# Altium project in3ator.PrjPcb (part 1 of 2)
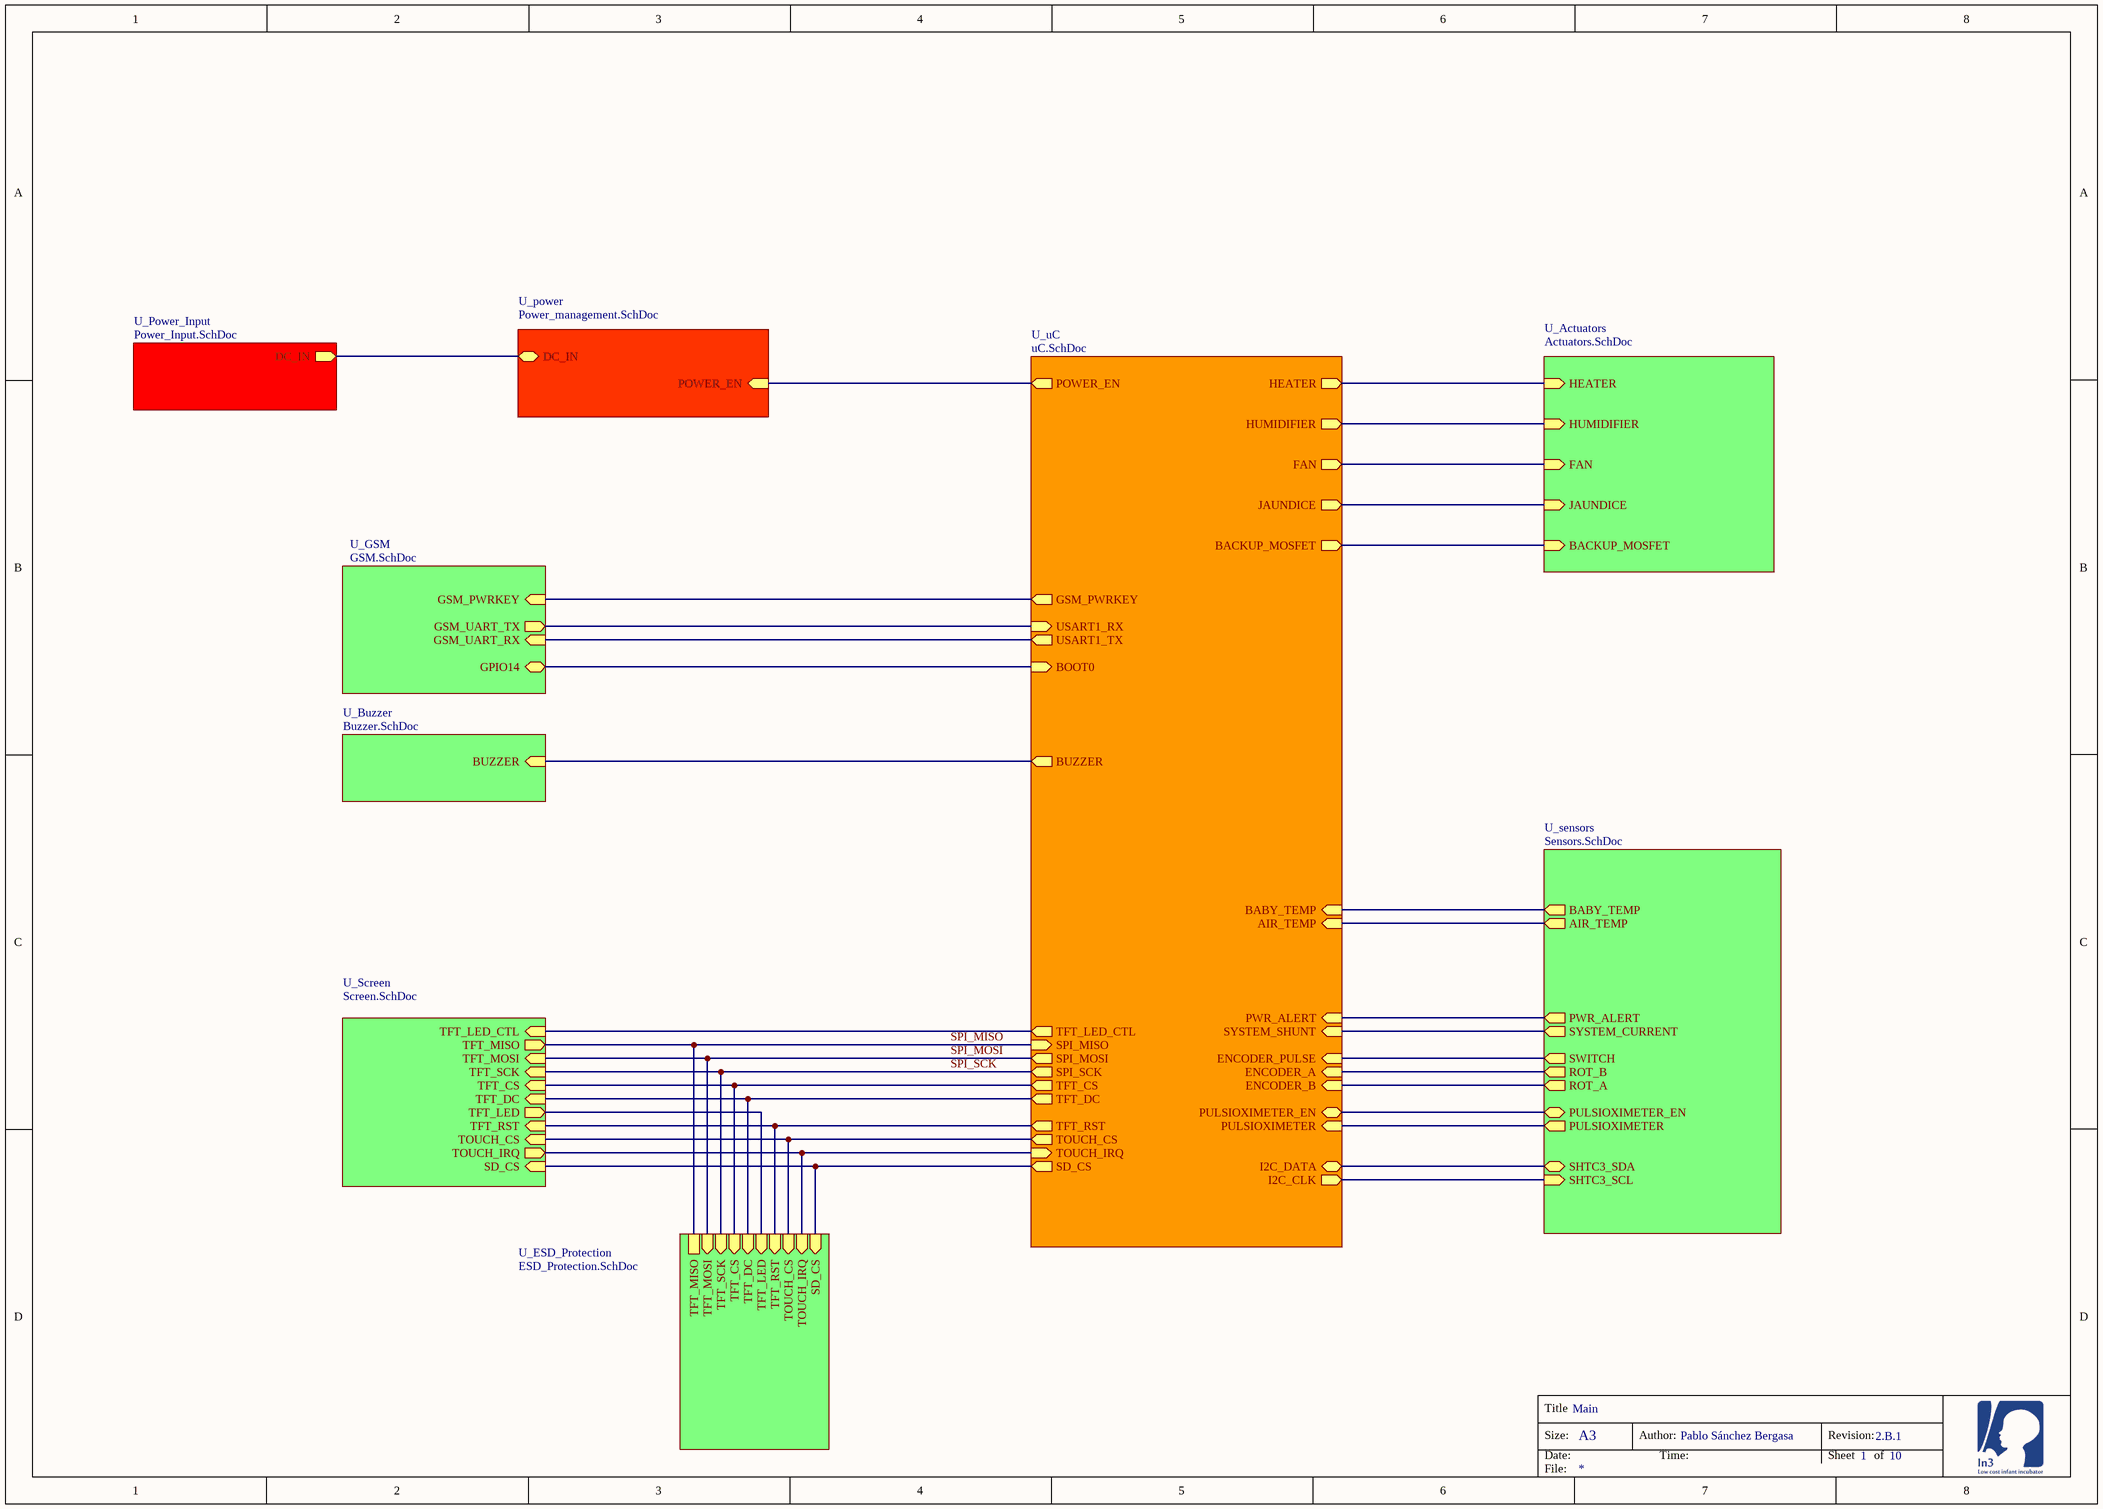
[diagram p0: in3ator.SchDoc]
Author_in3: Pablo Sánchez Bergasa; Revision_in3: 2.B.1; SheetTotal_in3: 10
10 sheets, 142 parts. Net scope: hierarchical (ports join the sheet entries above them; power ports are global).
Sheets:
  in3ator.SchDoc
    U_power = Power_management.SchDoc
    U_GSM = GSM.SchDoc
    U_sensors = Sensors.SchDoc
    U_uC = uC.SchDoc
    U_Power_Input = Power_Input.SchDoc
    U_Actuators = Actuators.SchDoc
    U_Buzzer = Buzzer.SchDoc
    U_Screen = Screen.SchDoc
    U_ESD_Protection = ESD_Protection.SchDoc

## Sheet in3ator.SchDoc: Main
size A3; Date: 17/09/18; Author: Pablo Sánchez Bergasa; Revision: 2.A.1; SheetNumber: 1; SheetTotal: 9; DocumentName: Main

### Sub-sheets
U_Actuators = Actuators.SchDoc: HEATER (in), HUMIDIFIER (in), JAUNDICE (in), FAN (in), BACKUP_MOSFET (in)
U_Buzzer = Buzzer.SchDoc: BUZZER (in)
U_ESD_Protection = ESD_Protection.SchDoc: SD_CS (in), TFT_CS (in), TOUCH_CS (in), TOUCH_IRQ (in), TFT_RST (in), TFT_DC (in), TFT_MOSI (in), TFT_SCK (in), TFT_LED (in), TFT_MISO
U_GSM = GSM.SchDoc: GSM_UART_TX (out), GSM_UART_RX (in), GSM_PWRKEY (in), GPIO14
U_power = Power_management.SchDoc: POWER_EN (in), DC_IN
U_Power_Input = Power_Input.SchDoc: DC_IN
U_Screen = Screen.SchDoc: SD_CS (in), TFT_CS (in), TOUCH_CS (in), TOUCH_IRQ (out), TFT_RST (in), TFT_DC (in), TFT_MOSI (in), TFT_MISO, TFT_LED_CTL (in), TFT_SCK (in), TFT_LED (out)
U_sensors = Sensors.SchDoc: SYSTEM_CURRENT (out), SWITCH (out), ROT_B (out), ROT_A (out), PULSIOXIMETER_EN, SHTC3_SCL (in), SHTC3_SDA (bidir), PWR_ALERT (out), PULSIOXIMETER (out), BABY_TEMP (out), AIR_TEMP (out)
U_uC = uC.SchDoc: SYSTEM_SHUNT (in), HEATER (out), BUZZER (out), JAUNDICE (out), HUMIDIFIER (out), POWER_EN (out), BOOT0 (in), FAN (out), I2C_DATA (bidir), I2C_CLK (out), SPI_MISO, SPI_SCK (out), SPI_MOSI (out), TOUCH_IRQ (in), TFT_DC (out), TFT_CS (out), TFT_RST (out), TOUCH_CS (out), SD_CS (out), TFT_LED_CTL (out), GSM_PWRKEY (out), USART1_RX (in), USART1_TX (out), ENCODER_PULSE (in), ENCODER_A (in), ENCODER_B (in), PULSIOXIMETER (in), PWR_ALERT (in), PULSIOXIMETER_EN, BACKUP_MOSFET (out), BABY_TEMP (in), AIR_TEMP (in)

### Nets
3v3_pulsioximeter: sheet U_sensors/PULSIOXIMETER_EN, sheet U_uC/PULSIOXIMETER_EN
DC_IN: sheet U_power/DC_IN, sheet U_Power_Input/DC_IN
GSM_RX: sheet U_GSM/GSM_UART_RX, sheet U_uC/USART1_TX
GSM_TX: sheet U_GSM/GSM_UART_TX, sheet U_uC/USART1_RX
PULSIOXIMETER_: sheet U_sensors/PULSIOXIMETER, sheet U_uC/PULSIOXIMETER
SCL: sheet U_sensors/SHTC3_SCL, sheet U_uC/I2C_CLK
SD_CS: sheet U_uC/SD_CS, sheet U_Screen/SD_CS, sheet U_ESD_Protection/SD_CS
SDA: sheet U_sensors/SHTC3_SDA, sheet U_uC/I2C_DATA
SPI_MISO: sheet U_uC/SPI_MISO, sheet U_Screen/TFT_MISO, sheet U_ESD_Protection/TFT_MISO
SPI_MOSI: sheet U_uC/SPI_MOSI, sheet U_Screen/TFT_MOSI, sheet U_ESD_Protection/TFT_MOSI
SPI_SCK: sheet U_uC/SPI_SCK, sheet U_Screen/TFT_SCK, sheet U_ESD_Protection/TFT_SCK
SYS_CURRENT: sheet U_sensors/SYSTEM_CURRENT, sheet U_uC/SYSTEM_SHUNT
TFT_CS: sheet U_uC/TFT_CS, sheet U_Screen/TFT_CS, sheet U_ESD_Protection/TFT_CS
TFT_DC: sheet U_uC/TFT_DC, sheet U_Screen/TFT_DC, sheet U_ESD_Protection/TFT_DC
TFT_LED: sheet U_Screen/TFT_LED, sheet U_ESD_Protection/TFT_LED
TFT_LED_CTL: sheet U_uC/TFT_LED_CTL, sheet U_Screen/TFT_LED_CTL
TFT_RST: sheet U_uC/TFT_RST, sheet U_Screen/TFT_RST, sheet U_ESD_Protection/TFT_RST
TOUCH_CS: sheet U_uC/TOUCH_CS, sheet U_Screen/TOUCH_CS, sheet U_ESD_Protection/TOUCH_CS
TOUCH_IRQ: sheet U_uC/TOUCH_IRQ, sheet U_Screen/TOUCH_IRQ, sheet U_ESD_Protection/TOUCH_IRQ
NetC17_1: sheet U_sensors/BABY_TEMP, sheet U_uC/BABY_TEMP
NetC18_2: sheet U_sensors/ROT_A, sheet U_uC/ENCODER_B
NetC19_2: sheet U_sensors/ROT_B, sheet U_uC/ENCODER_A
NetC20_2: sheet U_sensors/SWITCH, sheet U_uC/ENCODER_PULSE
NetC34_1: sheet U_sensors/AIR_TEMP, sheet U_uC/AIR_TEMP
NetQ2_1: sheet U_uC/HEATER, sheet U_Actuators/HEATER
NetQ3_1: sheet U_uC/HUMIDIFIER, sheet U_Actuators/HUMIDIFIER
NetQ4_1: sheet U_uC/FAN, sheet U_Actuators/FAN
NetQ5_1: sheet U_uC/JAUNDICE, sheet U_Actuators/JAUNDICE
NetQ6_1: sheet U_uC/BACKUP_MOSFET, sheet U_Actuators/BACKUP_MOSFET
NetR7_1: sheet U_GSM/GPIO14, sheet U_uC/BOOT0
NetR13_1: sheet U_GSM/GSM_PWRKEY, sheet U_uC/GSM_PWRKEY
NetR44_2: sheet U_uC/BUZZER, sheet U_Buzzer/BUZZER
NetR48_1: sheet U_power/POWER_EN, sheet U_uC/POWER_EN
NetU1#2_56: sheet U_sensors/PWR_ALERT, sheet U_uC/PWR_ALERT

### Notes on the sheet
- Title
- Size:
- Date:
- A3
- Author:
- Time:
- Revision:
- Sheet
- of
- File:

## Sheet Power_management.SchDoc: Power
size A3; SheetNumber: 3
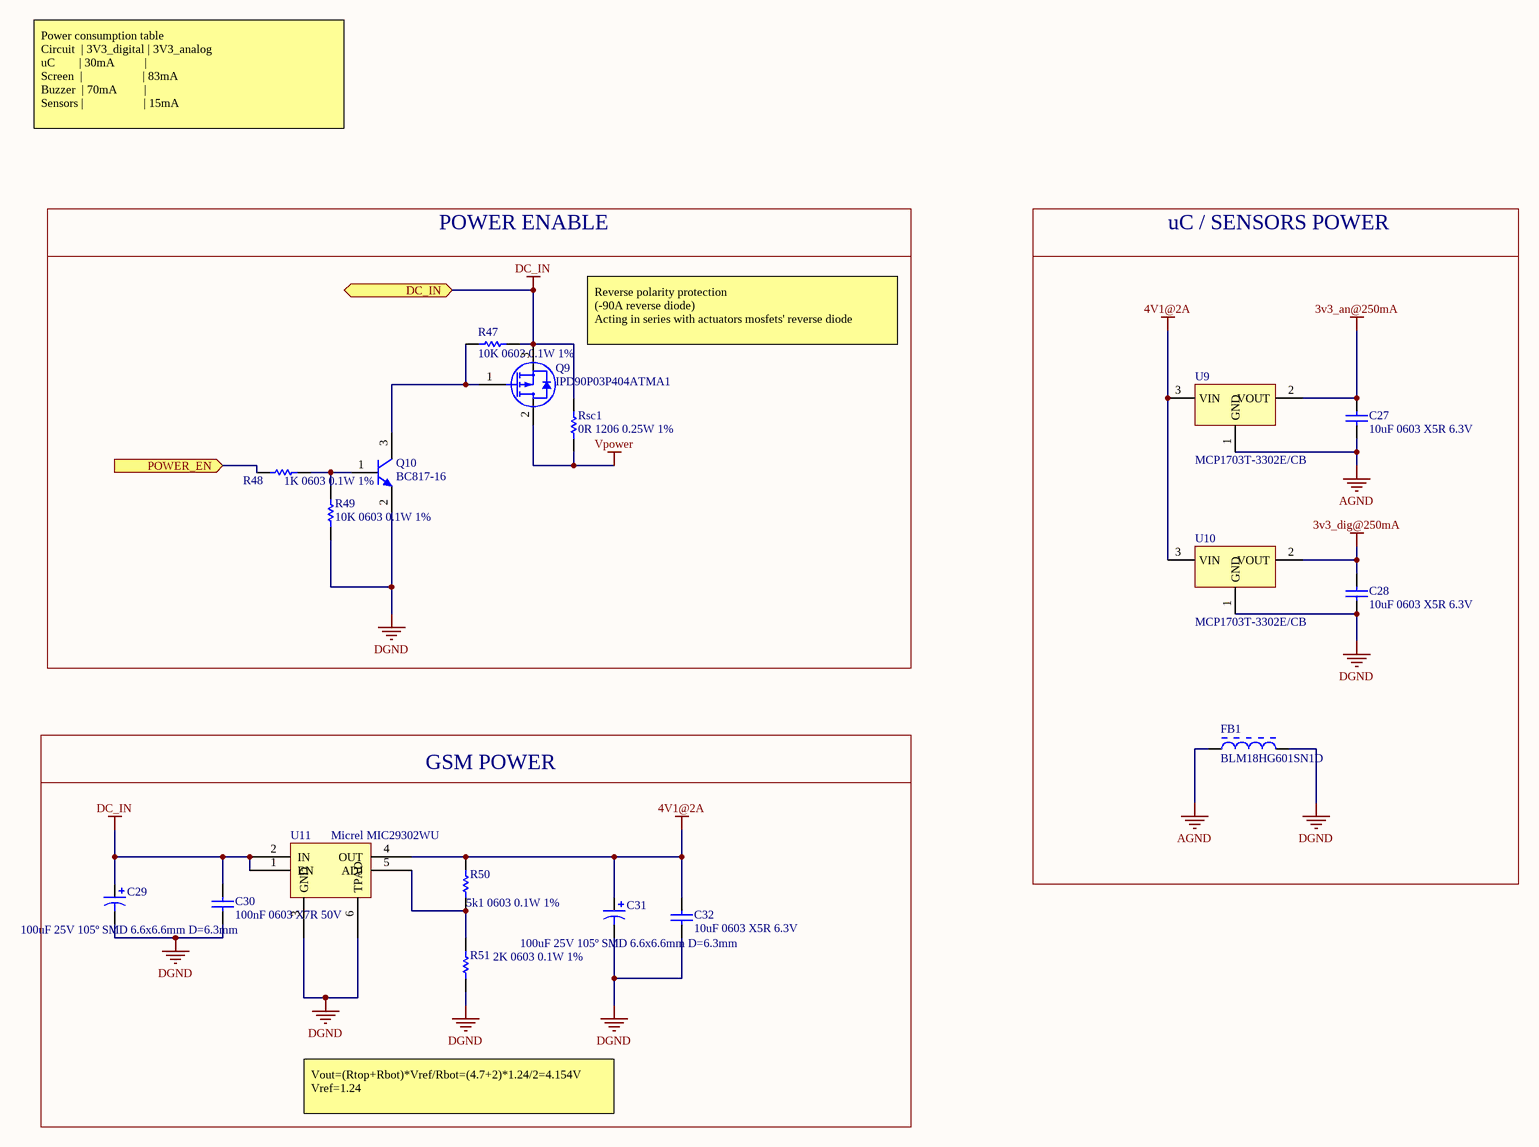
[diagram p1: Power_management.SchDoc]

### Parts
C27  10uF 0603 X5R 6.3V  [CAPC1608X60X35NL10T15]
C28  10uF 0603 X5R 6.3V  [CAPC1608X60X35NL10T15]
C29  100uF 25V 105º SMD 6.6x6.6mm D=6.3mm  [PCB-5eg0a5nygcrzw5ibm1j9-1]
C30  100nF 0603 X7R 50V  [CAPC1608X60X35NL10T15]
C31  100uF 25V 105º SMD 6.6x6.6mm D=6.3mm  [PCB-5eg0a5nygcrzw5ibm1j9-1]
C32  10uF 0603 X5R 6.3V  [CAPC1608X60X35NL10T15]
FB1  BLM18HG601SN1D  [MURA-BLM18-F-H1-CHIP-2_V]
Q9  IPD90P03P404ATMA1  [DPAK IPD90P03P404ATMA1]
Q10  BC817-16  [PCB-856332-1]
R47  10K 0603 0.1W 1%  [RESC1609X55X30ML10T20]
R48  1K 0603 0.1W 1%  [RESC1609X55X30ML10T20]
R49  10K 0603 0.1W 1%  [RESC1609X55X30ML10T20]
R50  5k1 0603 0.1W 1%  [RESC1609X55X30ML10T20]
R51  2K 0603 0.1W 1%  [RESC1609X55X30ML10T20]
Rsc1  0R 1206 0.25W 1%  [PCB-sxvxwfnl72ysl1kmtzgv-1]  (no BOM)
U9  MCP1703T-3302E/CB  [SOT-23A-CB3_L]
U10  MCP1703T-3302E/CB  [SOT-23A-CB3_L]
U11  Micrel MIC29302WU  [TI-KTT5_N]

### Blocks framed on the sheet
POWER ENABLE: Q9 Q10 R47-R49 Rsc1
uC / SENSORS POWER: C27 C28 FB1 U9 U10
GSM POWER: C29-C32 R50 R51 U11

### Ports
DC_IN, POWER_EN (in)

### Nets
3v3_an@250mA: C27.2 U9.2(VOUT)
3v3_dig@250mA: C28.2 U10.2(VOUT)
4V1@2A: C31.1 C32.2 R50.2 U9.3(VIN) U10.3(VIN) U11.4(OUT)
AGND: C27.1 FB1.1 U9.1(GND)
DC_IN: C29.1 C30.2 Q9.3(S) R47.2 Rsc1.2 U11.1(EN) U11.2(IN) ; port DC_IN
DGND: C28.1 C29.2 C30.1 C31.2 C32.1 FB1.2 Q10.2(E) R49.2 R51.1 U10.1(GND) U11.3(GND) U11.6(TPAD)
Vpower: Q9.2(D) Rsc1.1
NetQ9_1: Q9.1(G) Q10.3(C) R47.1
NetQ10_1: Q10.1(B) R48.2 R49.1
NetR48_1: R48.1 ; port POWER_EN
NetR50_1: R50.1 R51.2 U11.5(ADJ)

### Notes on the sheet
- Power consumption table
  Circuit  | 3V3_digital | 3V3_analog
  uC        | 30mA          |
  Screen  |                    | 83mA
  Buzzer  | 70mA         |
  Sensors |                    | 15mA
- Reverse polarity protection
  (-90A reverse diode)
  Acting in series with actuators mosfets' reverse diode
- Vout=(Rtop+Rbot)*Vref/Rbot=(4.7+2)*1.24/2=4.154V
  Vref=1.24
- Title
- Size:
- Date:
- A3
- Author:
- Time:
- Revision:
- Sheet
- of
- File:

### Library data of the parts
C27 C28 C32 = CMP-121364-8: Rated voltage: 6v3; Dielectric carachteristic: X5R; Capacitance: 10uF; package: 0603
C29 C31 = CMP-a6d16ad512617916-1: Manufacturer Part Number: VZL101M1ETR-0607; Tolerance: 20%; Octopart URL: https://octopart.com/vzl101m1etr-0607-lelon-84840918; OctopartID: a6d16ad512617916; Capacity: 100uF; Voltage rating: 25V
C30 = CMP-c41a0d2b65641bdd-3: 100nF 0603 X7R 25V; package: 0603; capacitance: 100 nF; Dielectric Characteristic: X7R; Rated voltage: 25V
FB1 = CMP-19299602-3: Current Rating: 0.2 A; Frequency: 100000000.0 Hz; Lead-Free Status: Lead Free; Number of Circuits: 1; Resistance: 600.0 Ω; Shielding: No; Value: 600ohm 200mA; Manufacturer Part Number: BLM18HG601SN1D; Case/Package: 0603; Mounting Style: Surface Mount; Number of Pins: 2; Octopart Url: https://octopart.com/blm18hg601sn1d-murata-368340; OctopartID: c121082e7a931ee6; REACH SVHC Compliance: No SVHC; RoHS: Compliant; Size-Height: 0.0008 m; Size-Length: 0.0016 m; Size-Width: 0.0008 m
Q9 = CMP-3103264-6: Single P-Channel 30 V 4.5 mOhm 100 nC OptiMOS Power Mosfet - TO-252-3-11; Lead-Free Status: Lead Free; REACH SVHC Compliance: No SVHC; Octopart URL: https://octopart.com/ipd90p03p404atma1-infineon-21386769; Polarity: P-Channel; RoHS: Compliant; Mounting Style: Surface Mount; Operating Temperature: 175 °C (max); Packaging: Reel; Number of Pins: 3; OctopartID: f6ad3ee185da296a; Manufacturer Part Number: IPD90P03P404ATMA1; Manufacturer Part Number 2: WSF70P03
Q10 = CMP-856332-3: TRANS NPN 45V 500mA SMD SOT23-3; Current Rating: 0.6 A; Lead-Free Status: Lead Free; Power Dissipation: 0.3 W; Voltage Rating (DC): 40.0 V; Case/Package: SOT-23; Lifecycle Status: Active; Mounting Style: Surface Mount; Number of Pins: 3; Octopart Url: https://octopart.com/mmbt2222a-7-f-diodes+inc.-357838; OctopartID: 53a79aa8030f8c60; Packaging: Cut Tape (CT); Polarity: NPN; REACH SVHC Compliance: No SVHC; RoHS: Compliant
R47 R49 = CMP-4716590-9: Octopart Url: https://octopart.com/crcw060310k0fkeahp-vishay-42634028; package: 0603; Resistance: 10k; Tolerance: 1%
  R47: DNP: DNP
R48 = CMP-a61f6f36030f79d8-4: Manufacturer Part Number: CR0603-FX-1001ELF; Power Rating: 100 mW; Case/Package (SI): 1608; Voltage Rating (DC): 50.0 V; Temperature Coefficient: -100 ppm/°C to 100 ppm/°C; REACH SVHC Compliance: No SVHC; Packaging: Tape & Reel (TR), Cut Tape (CT); Resistance Tolerance: ±1%; Resistance: 1k; RoHS: Compliant; Mounting Style: Surface Mount; Number of Pins: 2; Size-Length: 1.60 mm; Octopart URL: https://octopart.com/cr0603-fx-1001elf-bourns-2326646; Size-Thickness: 457 µm; OctopartID: a61f6f36030f79d8; Size-Width: 787 µm; Case/Package: 0603
R50 R51 = CMP-3655986-6: Tolerance: 1%; package: 0603
  R50: Resistance: 5k1
  R51: Resistance: 2K
Rsc1 = CMP-3f1bf473a47ce0dc-5: Manufacturer Part Number: RC1206JR-070RL; Lead-Free Status: Lead Free; Resistance Tolerance: ±5%; Voltage Rating (DC): 200 V; Power Rating: 250 mW; Case/Package (SI): 3216; Resistance: 0R; Packaging: Cut Tape (CT), Tape & Reel (TR); Size-Width: 1.60 mm; Case/Package: 1206; Mounting Style: Surface Mount; Size-Length: 3.10 mm; OctopartID: 3f1bf473a47ce0dc; Number of Pins: 2; RoHS: Compliant
U9 U10 = CMP-1493313-4: Lead-Free Status: Lead Free; Number of Outputs: 1; Output Capacitor Type: Ceramic; Quiescent Current: 2e-06 A; Dropout Voltage: 0.65 V; RoHS: Compliant; Mounting Style: Surface Mount; OctopartID: 3caef5ca6a72e369; Packaging: Cut Tape (CT); Octopart Url: https://octopart.com/mcp1703t-3302e%2Fcb-microchip-7238586; Lifecycle Status: Active; Number of Pins: 3; REACH SVHC Compliance: No SVHC; Manufacturer Part Number: MCP1703T-3302E/CB
U11 = CMP-703eb93c7bacaff9-6: MIC29302 Series 3 A 1.24 to 26 V ADJ Output Voltage LDO Regulator - TO-263-5

## Sheet GSM.SchDoc: GSM
size A4; SheetNumber: 5
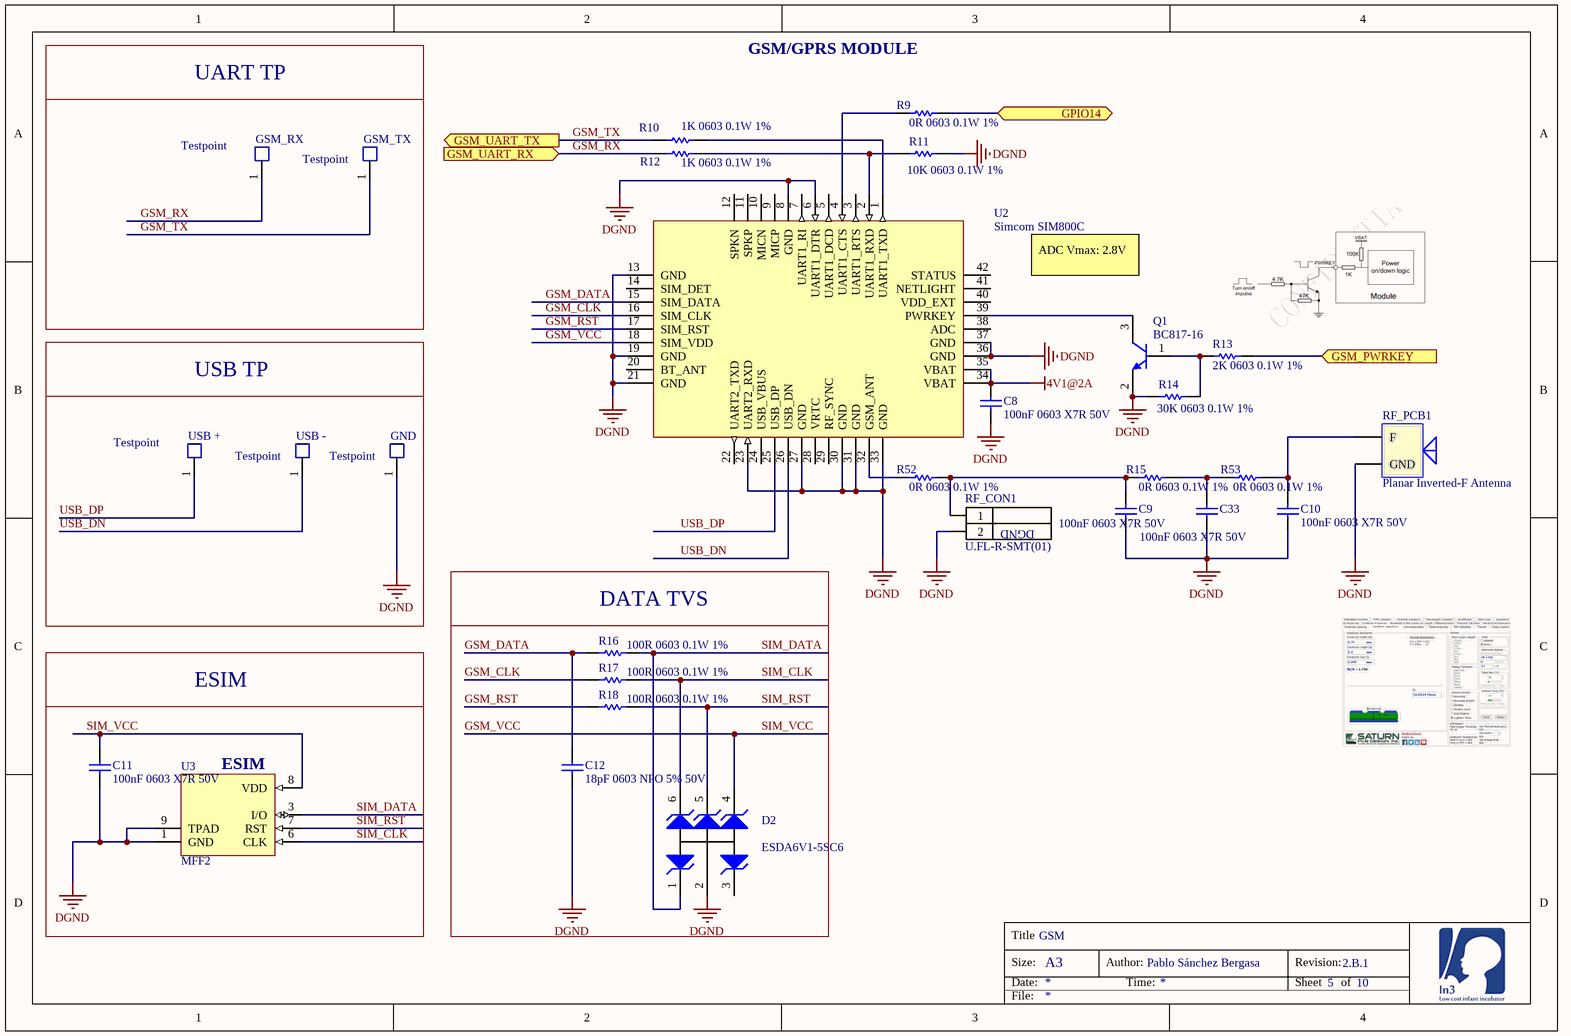
[diagram p2: GSM.SchDoc]

### Parts
C8  100nF 0603 X7R 50V  [CAPC1608X60X35NL10T15]
C9  100nF 0603 X7R 50V  [CAPC1608X60X35NL10T15]
C10  100nF 0603 X7R 50V  [CAPC1608X60X35NL10T15]
C11  100nF 0603 X7R 50V  [CAPC1608X60X35NL10T15]
C12  18pF 0603 NPO 5% 50V  [CAPC1608X60X35NL10T15]
C33  100nF 0603 X7R 50V  [CAPC1608X60X35NL10T15]
D2  ESDA6V1-5SC6  [MF06A_N]
GND  Testpoint  [PCB-nm3bqur1hdh465dxvdoy-1]  (no BOM)
GSM_RX  Testpoint  [PCB-nm3bqur1hdh465dxvdoy-1]  (no BOM)
GSM_TX  Testpoint  [PCB-nm3bqur1hdh465dxvdoy-1]  (no BOM)
Q1  BC817-16  [PCB-856332-1]
R9  0R 0603 0.1W 1%  [RESC1609X55X30ML10T20]
R10  1K 0603 0.1W 1%  [RESC1609X55X30ML10T20]
R11  10K 0603 0.1W 1%  [RESC1609X55X30ML10T20]
R12  1K 0603 0.1W 1%  [RESC1609X55X30ML10T20]
R13  2K 0603 0.1W 1%  [RESC1609X55X30ML10T20]
R14  30K 0603 0.1W 1%  [RESC1609X55X30ML10T20]
R15  0R 0603 0.1W 1%  [RESC1609X55X30ML10T20]
R16  100R 0603 0.1W 1%  [RESC1609X55X30ML10T20]
R17  100R 0603 0.1W 1%  [RESC1609X55X30ML10T20]
R18  100R 0603 0.1W 1%  [RESC1609X55X30ML10T20]
R52  0R 0603 0.1W 1%  [RESC1609X55X30ML10T20]
R53  0R 0603 0.1W 1%  [RESC1609X55X30ML10T20]
RF_CON1  U.FL-R-SMT(01)  [PCB-ci0d6ius1xp1vci7q9ug-1]
RF_PCB1  Planar Inverted-F Antenna  [PCB-k9titb4465gfk1ijwrnj-1]
U2  Simcom SIM800C  [SIM800C]
U3  MFF2  [SON127P600X95_HS-9N]
USB_+  Testpoint  [PCB-nm3bqur1hdh465dxvdoy-1]  (no BOM)
USB_-  Testpoint  [PCB-nm3bqur1hdh465dxvdoy-1]  (no BOM)

### Blocks framed on the sheet
UART TP: GSM_RX GSM_TX
USB TP: GND USB_+ USB_-
DATA TVS: C12 D2 R16-R18
ESIM: C11 U3

### Ports
GPIO14, GSM_PWRKEY (in), GSM_UART_RX (in), GSM_UART_TX (out)

### Nets
4V1@2A: C8.2 U2.34(VBAT) U2.35(VBAT)
DGND: C8.1 C9.1 C10.1 C11.1 C12.1 C33.1 D2.2(K) GND.1 Q1.2(E) R11.2 R14.2 RF_CON1.2 RF_PCB1.2(GND) U2.6(UART1_DTR) U2.8(GND) U2.13(GND) U2.19(GND) U2.21(GND) U2.23(UART2_RXD) U2.27(GND) U2.30(GND) U2.31(GND) U2.33(GND) U2.36(GND) U2.37(GND) U3.1(GND) U3.9(TPAD)
GSM_CLK: R17.2 U2.16(SIM_CLK)
GSM_DATA: C12.2 R16.2 U2.15(SIM_DATA)
GSM_RST: R18.2 U2.17(SIM_RST)
GSM_RX: GSM_RX.1 R12.1 ; port GSM_UART_RX
GSM_TX: GSM_TX.1 R10.1 ; port GSM_UART_TX
GSM_VCC: C11.2 D2.4(A) U2.18(SIM_VDD) U3.8(VDD)  [also labelled SIM_VCC]
SIM_CLK: D2.6(A) R17.1 U3.6(CLK)
SIM_DATA: D2.1(K) R16.1 U3.3(I/O)
SIM_RST: D2.5(A) R18.1 U3.7(RST)
USB_DN: U2.26(USB_DN) USB_-.1
USB_DP: U2.25(USB_DP) USB_+.1
NetC9_2: C9.2 R15.1 R52.2 RF_CON1.1
NetC10_2: C10.2 R53.2 RF_PCB1.1(F)
NetC33_2: C33.2 R15.2 R53.1
NetQ1_1: Q1.1(B) R13.2 R14.1
NetQ1_3: Q1.3(C) U2.39(PWRKEY)
NetR7_1: R9.2 ; port GPIO14
NetR9_1: R9.1 U2.4(UART1_CTS)
NetR10_2: R10.2 U2.1(UART1_TXD)
NetR11_1: R11.1 R12.2 U2.2(UART1_RXD)
NetR13_1: R13.1 ; port GSM_PWRKEY
NetR52_1: R52.1 U2.32(GSM_ANT)

Not connected (* = marked no-connect by the designer): D2 3(K); U2 3(UART1_RTS) 5(UART1_DCD) 7(UART1_RI) 9(MICP) 10(MICN) 11(SPKP) 12(SPKN) 14(SIM_DET) 20(BT_ANT) 22(UART2_TXD) 24(USB_VBUS) 28(VRTC) 29(RF_SYNC) 38(ADC) 40(VDD_EXT) 41(NETLIGHT) 42(STATUS)

### Notes on the sheet
- GSM/GPRS MODULE
- ADC Vmax: 2.8V
- (near U3) ESIM
- Title
- Size:
- Date:
- A3
- Author:
- Time:
- Revision:
- Sheet
- of
- File:
- (in symbol CMP-b06f7b3edcee6fa8-4) DGND

### Library data of the parts
C8-C11 C33 = CMP-c41a0d2b65641bdd-3: 100nF 0603 X7R 25V; package: 0603; capacitance: 100 nF; Dielectric Characteristic: X7R; Rated voltage: 25V
C12 = CMP-35cbf9f8b0acea0c-1: Manufacturer Part Number: C0603C180K5RACTU; Capacitance: 18.0 pF; Capacitance Tolerance: ±10%; Dielectric Characteristic: X7R; Dielectric Material: Ceramic; Lead-Free Status: R; Voltage Rating (DC): 50.0 V; Octopart URL: https://octopart.com/c0603c180k5racauto-kemet-87662593; Case/Package: 0603; Mounting Style: Surface Mount; Operating Temperature: -55.0 °C (min); RoHS: Compliant; OctopartID: 35cbf9f8b0acea0c
D2 = CMP-924f5b40f9684d88-1: ESDA Series 5 Channel 6.1 V 50 pF SMT Uni Directional Transil Array - SOT-23-6L; Operating Voltage: 6.10 V; Power Rating: 100 W; Breakdown Voltage: 7.20 V; Lead-Free Status: Lead Free; REACH SVHC Compliance: No SVHC; Number of Pins: 6; Case/Package: SOT-23; Size-Width: 1.75 mm; Mounting Style: Surface Mount; Manufacturer Part Number: ESDA6V1-5SC6; Size-Height: 1.45 mm; OctopartID: 924f5b40f9684d88; Size-Length: 3.05 mm; Packaging: Tape & Reel (TR), Cut Tape (CT); Octopart URL: http://octopart.com/esda6v1-5sc6-stmicroelectronics-347713; RoHS: Compliant; Voltage Rating (DC): 6.10 V; Lifecycle Status: Active; TME: ESDA6V1-5SC6
GND GSM_RX GSM_TX USB_+ USB_- = CMP-0fe9c5016150d02e-1: WR-PHD_1.27MM_JUMPER_BLACK W/ Pu; Octopart URL: https://octopart.com/622002115121-w%C3%BCrth+elektronik-65162207; Contact Material: Copper Alloy
Q1 = CMP-856332-3: as Q10 on sheet Power_management; Case/Package: SOT-23; Lifecycle Status: Active; Mounting Style: Surface Mount; Number of Pins: 3; Octopart Url: https://octopart.com/mmbt2222a-7-f-diodes+inc.-357838; OctopartID: 53a79aa8030f8c60; Packaging: Cut Tape (CT); Polarity: NPN; REACH SVHC Compliance: No SVHC; RoHS: Compliant
R9 R15 R52 R53 = CMP-536b9a7387ce8cac-10: HelpURL: http://www.yageo.com/documents/recent/PYu-RC_Group_51_RoHS_L_9.pdf; Resistance: 0R; package: 0603
R10 R12 = CMP-a61f6f36030f79d8-4: as R48 on sheet Power_management; REACH SVHC Compliance: No SVHC; Packaging: Tape & Reel (TR), Cut Tape (CT); Resistance Tolerance: ±1%; Resistance: 1k; RoHS: Compliant; Mounting Style: Surface Mount; Number of Pins: 2; Size-Length: 1.60 mm; Octopart URL: https://octopart.com/cr0603-fx-1001elf-bourns-2326646; Size-Thickness: 457 µm; OctopartID: a61f6f36030f79d8; Size-Width: 787 µm; Case/Package: 0603
R11 = CMP-4716590-9: Octopart Url: https://octopart.com/crcw060310k0fkeahp-vishay-42634028; package: 0603; Resistance: 10k; Tolerance: 1%
R13 R14 = CMP-3655986-6: Tolerance: 1%; package: 0603
  R13: Resistance: 2K
  R14: Resistance: 30k
R16-R18 = CMP-a61f6f36030f79d8-4: Manufacturer Part Number: ERJ3GEYJ101V; Power Rating: 100 mW; Resistance: 1k; Case/Package (SI): 1608; Voltage Rating (DC): 50.0 V; Temperature Coefficient: -100 ppm/°C to 100 ppm/°C; REACH SVHC Compliance: No SVHC; Packaging: Tape & Reel (TR), Cut Tape (CT); Resistance Tolerance: ±1%; RoHS: Compliant; Mounting Style: Surface Mount; Number of Pins: 2; Size-Length: 1.60 mm; Octopart URL: https://octopart.com/cr0603-fx-1001elf-bourns-2326646; Size-Thickness: 457 µm; OctopartID: a61f6f36030f79d8; Size-Width: 787 µm; Case/Package: 0603
RF_CON1 = CMP-b06f7b3edcee6fa8-4: Connector RF Coaxial Data Midget Coaxial; DNP: DNP
RF_PCB1 = CMP-e704afk8c25r4a5ypw1c-12: GSM900 and GSM1800  Frequency Bands PCB antenna; CustomComponentID: e704afk8c25r4a5ypw1c
U2 = CMP-72dbb8ea0133ad1c-5: Module: GSM/Bluetooth; GPRS; 2G; 1800MHz, 900MHz; 85.6kbps; SMD; OctopartID: 72dbb8ea0133ad1c; Manufacturer Part Number: SIM800C; Mounting Style: Surface Mount; Octopart URL: http://octopart.com/sim800c-simcom-54220430
U3 = CMP-ce8f06c57f401148-2: Embedded SIM card in MFF2; DNP: DNP

## Sheet Sensors.SchDoc: Sensors
size A3; SheetNumber: 7
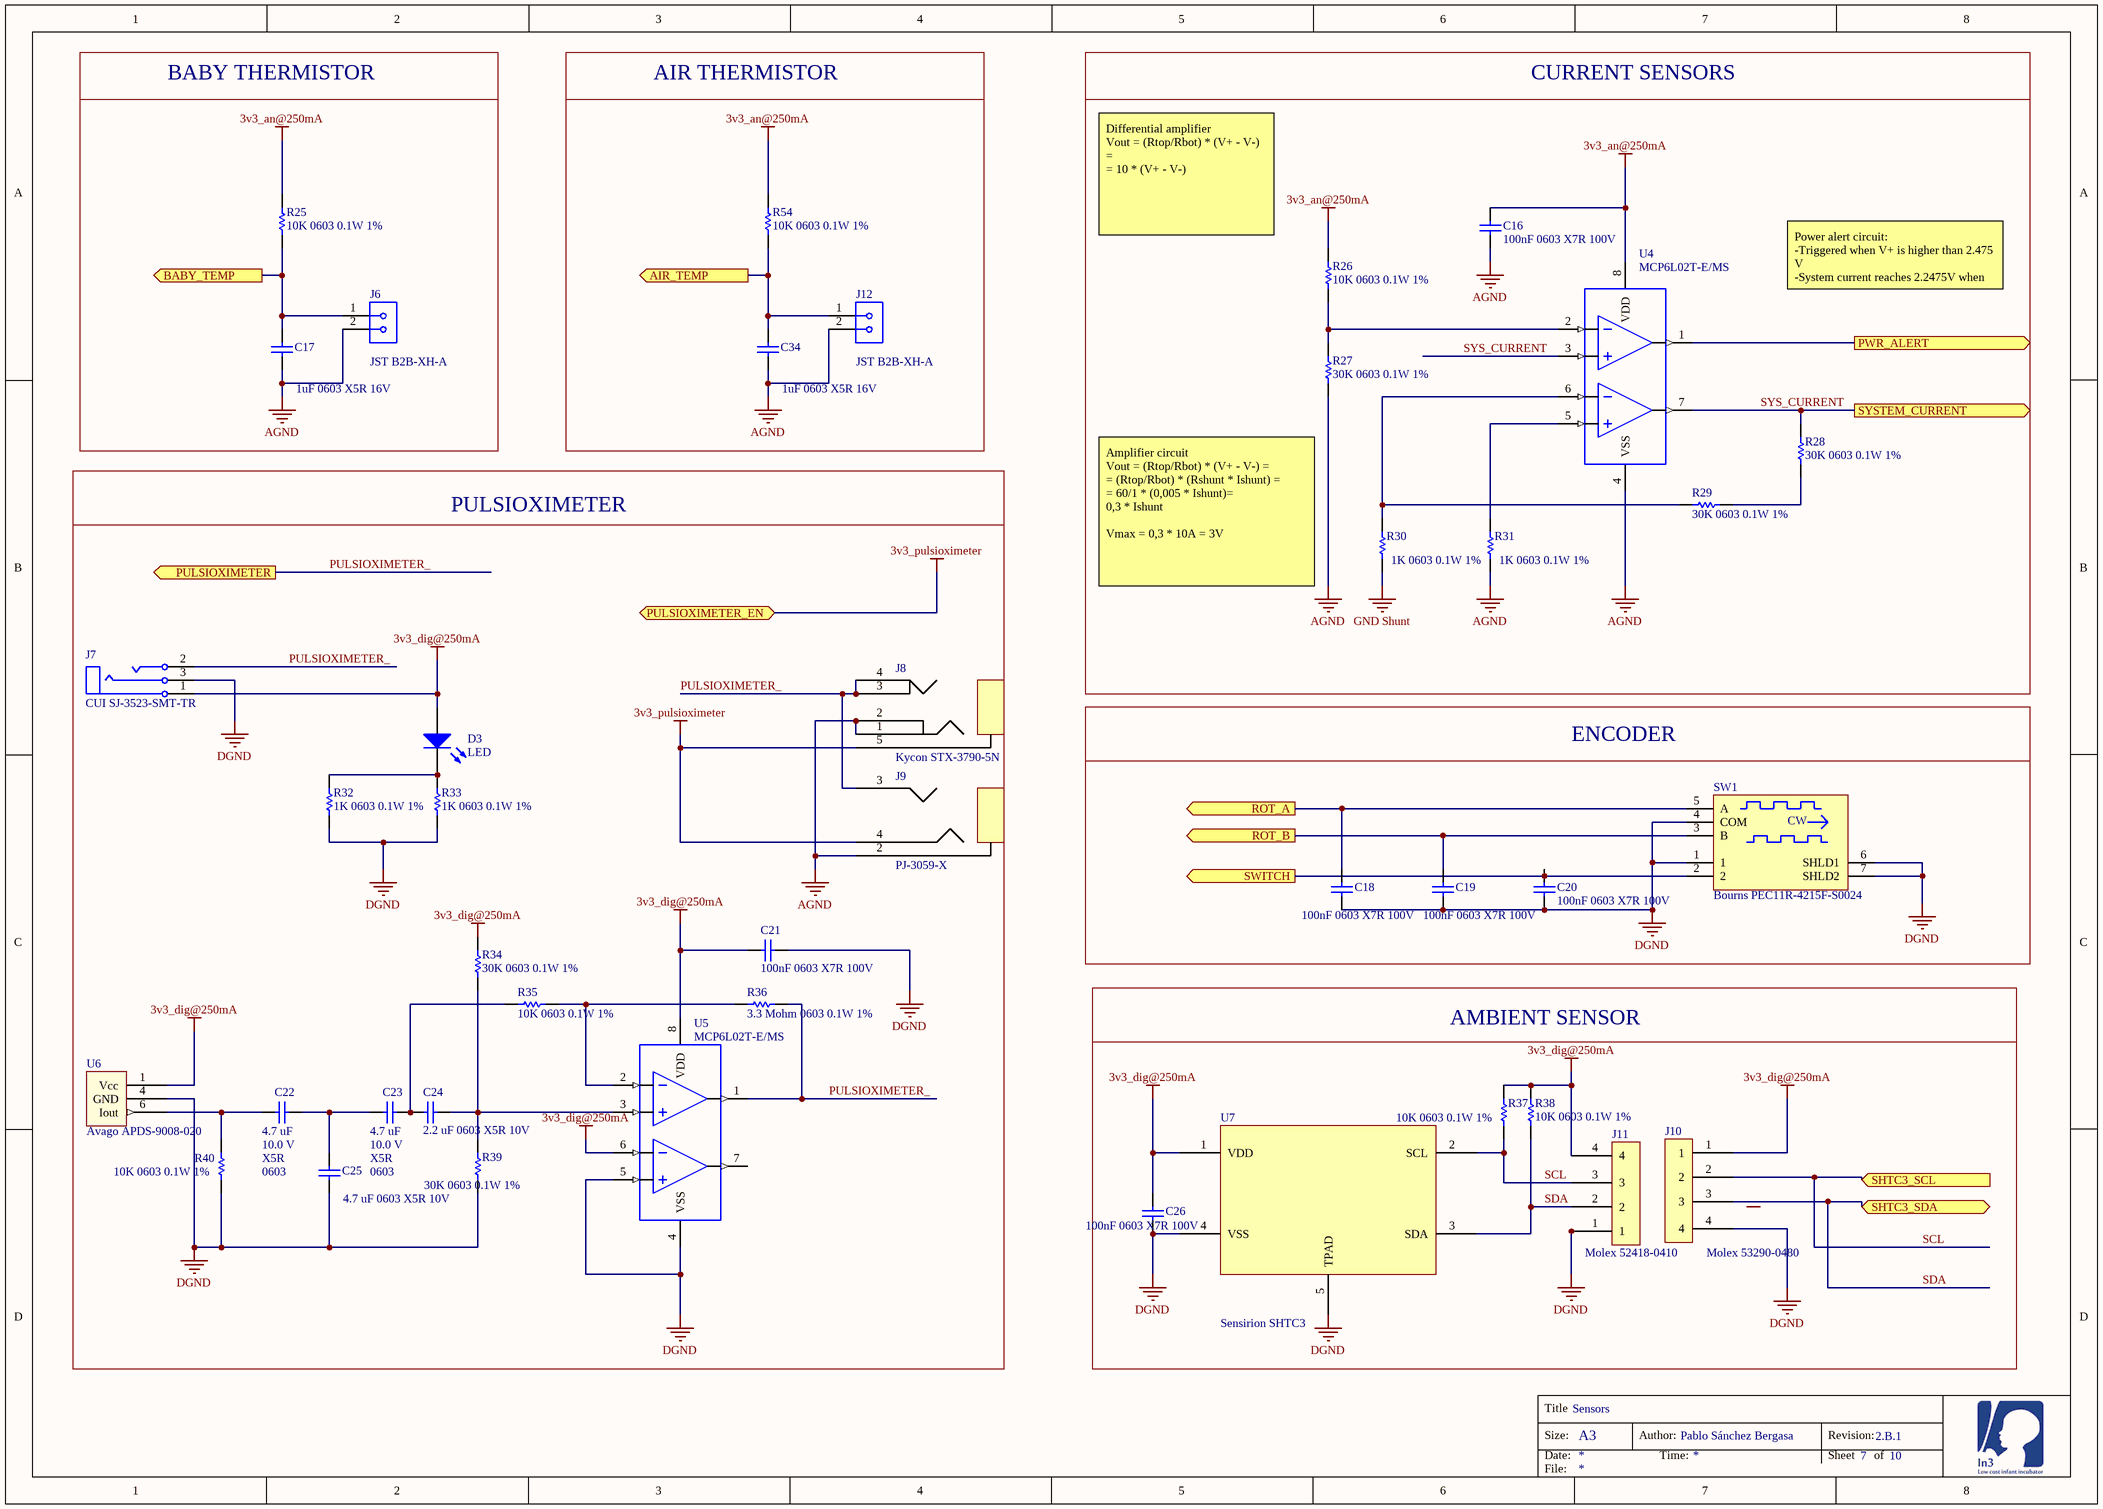
[diagram p3: Sensors.SchDoc]

### Parts
C16  100nF 0603 X7R 100V  [CAPC1608X60X35NL10T15]
C17  1uF 0603 X5R 16V  [CAPC1608X60X35NL10T15]
C18  100nF 0603 X7R 100V  [CAPC1608X60X35NL10T15]
C19  100nF 0603 X7R 100V  [CAPC1608X60X35NL10T15]
C20  100nF 0603 X7R 100V  [CAPC1608X60X35NL10T15]
C21  100nF 0603 X7R 100V  [CAPC1608X60X35NL10T15]  (no BOM)
C22  Capacitance: 4.7 uF  Dielectric Characteristic: X5R  Voltage Rating (DC): 10.0 V  Case/Package: 0603  [PCB-o44e25ijbg7jfnbnmamr-1]  (hidden comment: 4.7 uF 0603 X5R 10V)  (no BOM)
C23  Capacitance: 4.7 uF  Dielectric Characteristic: X5R  Voltage Rating (DC): 10.0 V  Case/Package: 0603  [PCB-o44e25ijbg7jfnbnmamr-1]  (hidden comment: 4.7 uF 0603 X5R 10V)  (no BOM)
C24  2.2 uF 0603 X5R 10V  [PCB-ut6qvzar43b06cy077h6-1]  (no BOM)
C25  4.7 uF 0603 X5R 10V  [PCB-o44e25ijbg7jfnbnmamr-1]  (no BOM)
C26  100nF 0603 X7R 100V  [CAPC1608X60X35NL10T15]
C34  1uF 0603 X5R 16V  [CAPC1608X60X35NL10T15]
D3  LED  [Diode]  (no BOM)
J6  JST B2B-XH-A  [PCB-pp1at3pfx7vls1ur72ey-1]
J7  CUI SJ-3523-SMT-TR  [PCB-wpf2idtw6ymbd7wafvje-1]  (no BOM)
J8  Kycon STX-3790-5N  [PCB-4j7k1xhz8vc7zbr3u2za-1]  (no BOM)
J9  PJ-3059-X  [PCB-ylnrsqqp1zh2nrt13053-1]  (no BOM)
J10  Molex 53290-0480  [PCB-az7j7v00du7ll54n3o04-1]
J11  Molex 52418-0410  [PCB-2exqb8kt510pgx9iz0yo-1]
J12  JST B2B-XH-A  [PCB-pp1at3pfx7vls1ur72ey-1]
R25  10K 0603 0.1W 1%  [RESC1609X55X30ML10T20]
R26  10K 0603 0.1W 1%  [RESC1609X55X30ML10T20]
R27  30K 0603 0.1W 1%  [RESC1609X55X30ML10T20]
R28  30K 0603 0.1W 1%  [RESC1609X55X30ML10T20]
R29  30K 0603 0.1W 1%  [RESC1609X55X30ML10T20]
R30  1K 0603 0.1W 1%  [RESC1609X55X30ML10T20]
R31  1K 0603 0.1W 1%  [RESC1609X55X30ML10T20]
R32  1K 0603 0.1W 1%  [RESC1609X55X30ML10T20]  (no BOM)
R33  1K 0603 0.1W 1%  [RESC1609X55X30ML10T20]  (no BOM)
R34  30K 0603 0.1W 1%  [RESC1609X55X30ML10T20]  (no BOM)
R35  10K 0603 0.1W 1%  [RESC1609X55X30ML10T20]  (no BOM)
R36  3.3 Mohm 0603 0.1W 1%  [PCB-mzxdg9kz9211q53vmmjz-1]  (no BOM)
R37  10K 0603 0.1W 1%  [RESC1609X55X30ML10T20]
R38  10K 0603 0.1W 1%  [RESC1609X55X30ML10T20]
R39  30K 0603 0.1W 1%  [RESC1609X55X30ML10T20]  (no BOM)
R40  10K 0603 0.1W 1%  [RESC1609X55X30ML10T20]  (no BOM)
R54  10K 0603 0.1W 1%  [RESC1609X55X30ML10T20]
SW1  Bourns PEC11R-4215F-S0024  [BOUR-PEC11R-4XXXF-SXXXX_V]
U4  MCP6L02T-E/MS  [PCB-e8n0jpjj0ctkgxf737qv-1]
U5  MCP6L02T-E/MS  [PCB-e8n0jpjj0ctkgxf737qv-1]  (no BOM)
U6  Avago APDS-9008-020  [PCB-5zuy5omviewwv0vuvsb9-1]  (no BOM)
U7  Sensirion SHTC3  [DFN4 2x2 + EP]

### Blocks framed on the sheet
BABY THERMISTOR: C17 J6 R25
AIR THERMISTOR: C34 J12 R54
CURRENT SENSORS: C16 R26-R31 U4
PULSIOXIMETER: C21-C25 D3 J7-J9 R32-R36 R39 R40 U5 U6
ENCODER: C18-C20 SW1
AMBIENT SENSOR: C26 J10 J11 R37 R38 U7

### Ports
AIR_TEMP (out), BABY_TEMP (out), PULSIOXIMETER (out), PULSIOXIMETER_EN, PWR_ALERT (out), ROT_A (out), ROT_B (out), SHTC3_SCL (in), SHTC3_SDA (bidir), SWITCH (out), SYSTEM_CURRENT (out)

### Nets
3v3_an@250mA: C16.2 R25.1 R26.1 R54.1 U4.8(VDD)
3v3_dig@250mA: C21.2 C26.2 D3.1(A) J7.1(SLEEVE) J10.1 J11.4 R34.1 R37.1 R38.1 U5.6(VINB-) U5.8(VDD) U6.1(Vcc) U7.1(VDD)
3v3_pulsioximeter: J8.5(GND) J9.4(RIGHT) ; port PULSIOXIMETER_EN
AGND: C16.1 C17.2 C34.2 J6.2 J8.1(RIGHT) J8.2(RIGHT) J9.2(GND) J12.2 R27.2 R31.1 U4.4(VSS)
DGND: C18.1 C19.1 C20.1 C21.1 C25.2 C26.1 J7.3(RING) J10.4 J11.1 R32.1 R33.1 R39.2 R40.1 SW1.1 SW1.4(COM) SW1.6(SHLD1) SW1.7(SHLD2) U5.4(VSS) U5.5(VINB+) U6.4(GND) U7.4(VSS) U7.5(TPAD)
GND Shunt: R30.1
PULSIOXIMETER_: J7.2(TIP) J8.3(RIGHT) J8.4(LEFT) J9.3(LEFT) R36.2 U5.1(VOUTA) ; port PULSIOXIMETER
SCL: J10.2 J11.3 R37.2 U7.2(SCL) ; port SHTC3_SCL
SDA: J10.3 J11.2 R38.2 U7.3(SDA) ; port SHTC3_SDA
SYS_CURRENT: R28.1 U4.3(VINA+) U4.7(OUT_B) ; port SYSTEM_CURRENT
NetC17_1: C17.1 J6.1 R25.2 ; port BABY_TEMP
NetC18_2: C18.2 SW1.5(A) ; port ROT_A
NetC19_2: C19.2 SW1.3(B) ; port ROT_B
NetC20_2: C20.2 SW1.2 ; port SWITCH
NetC22_1: C22.1 C23.2 C25.1
NetC22_2: C22.2 R40.2 U6.6(Iout)
NetC23_1: C23.1 C24.2 R35.1
NetC24_1: C24.1 R34.2 R39.1 U5.3(VINA+)
NetC34_1: C34.1 J12.1 R54.2 ; port AIR_TEMP
NetD3_2: D3.2(K) R32.2 R33.2
NetR26_2: R26.2 R27.1 U4.2(VINA-)
NetR28_2: R28.2 R29.2
NetR29_1: R29.1 R30.2 U4.6(VINB-)
NetR31_2: R31.2 U4.5(VINB+)
NetR35_2: R35.2 R36.1 U5.2(VINA-)
NetU1#2_56: U4.1(VOUTA) ; port PWR_ALERT

Not connected (* = marked no-connect by the designer): U5 7(OUT_B)

### Notes on the sheet
- Differential amplifier
  Vout = (Rtop/Rbot) * (V+ - V-) =
  = 10 * (V+ - V-)
- Power alert circuit:
  -Triggered when V+ is higher than 2.475 V
  -System current reaches 2.2475V when 8.25A are drawn
- Amplifier circuit
  Vout = (Rtop/Rbot) * (V+ - V-) =
  = (Rtop/Rbot) * (Rshunt * Ishunt) =
  = 60/1 * (0,005 * Ishunt)=
  0,3 * Ishunt
  Vmax = 0,3 * 10A = 3V
- Title
- Size:
- Date:
- A3
- Author:
- Time:
- Revision:
- Sheet
- of
- File:
- (in symbol CMP-7675167-7) CW

### Library data of the parts
C16 C18-C21 C26 = CMP-c41a0d2b65641bdd-3: Manufacturar Part Number: CC0603KRX7R0BB104; package: 0603; capacitance: 100 nF; Dielectric Characteristic: X7R; Rated voltage: 100V
C17 C34 = CMP-119984-2: Manufacturer Part Number: GRM185R61C105KE44D; Capacitance Tolerance: ±10%; Case/Package (in): 0603; Lead-Free Status: Lead Free; Capacitance: 1uF; Dielectric Characteristic: X5R; Lifecycle Status: Active; Mounting Style: Surface Mount; Number of Pins: 2; Octopart Url: https://octopart.com/grm185r61c105ke44d-murata-197446; OctopartID: de3e1737f81e01f9; REACH SVHC Compliance: No SVHC; RoHS: Compliant; Size-Height: 0.0005 m; Size-Length: 0.0016 m; Size-Thickness: 0.0005 m; Size-Width: 0.0008 m; Rated voltage: 16V
C22 C23 = CMP-4caf8516eb679368-2: CL10 Series 4.7 uF 10 V ±10 % Tolerance X5R SMT Multilayer Ceramic Capacitor; Manufacturer Part Number: CL10A475KP8NNNC; Capacitance Tolerance: ±10%; Lead-Free Status: Lead Free; OctopartID: 4caf8516eb679368; Octopart URL: http://octopart.com/cl10a475kp8nnnc-samsung-11764398; Mounting Style: Surface Mount; RoHS: Compliant
C24 = CMP-3568fc1ddfcfeaaf-3: Capacitor: ceramic; MLCC; 2.2uF; 10V; X5R; ±10%; SMD; 0603; -55÷85°C; Manufacturer Part Number: CL10A225KP8NNNC; Capacitance: 2.20 µF; Manufacturer Part Number 2: EMK107BJ225MA-T
C25 = CMP-4caf8516eb679368-2: CL10 Series 4.7 uF 10 V ±10 % Tolerance X5R SMT Multilayer Ceramic Capacitor; Manufacturer Part Number: CL10A475KP8NNNC; Capacitance: 4.7 uF; Capacitance Tolerance: ±10%; Lead-Free Status: Lead Free; Voltage Rating (DC): 10.0 V; OctopartID: 4caf8516eb679368; Octopart URL: http://octopart.com/cl10a475kp8nnnc-samsung-11764398; Mounting Style: Surface Mount; Dielectric Characteristic: X5R; Case/Package: 0603; RoHS: Compliant
D3 = CMP-528b9bd0c0208d4c-1: Green 2.5 x 2 x 2.8 mm 20° Clear 2700 mcd 3.3 V Subminiature Solid State LED SMT; Manufacturer Part Number: AM2520ZGC09; Lead-Free Status: Lead Free; RoHS: Compliant
J6 J12 = CMP-1d67d451da9ec2a0-3: Conn Shrouded Header HDR 2 POS 2.5mm Solder ST Thru-Hole Box; Contact Material: Phosphor Bronze; OctopartID: 1d67d451da9ec2a0; Orientation: Straight; Octopart URL: https://octopart.com/b2b-xh-a-jst-3990175; Manufacturer Part Number: B2B-XH-A
J7 = CMP-4733509-15: Conn 3.5MM Stereo Jack F 3 POS Solder RA SMD 3 Terminal 1 Port T/R; Shielding: No; Lead-Free Status: Lead Free; Gender: Female; Packaging: Tape & Reel (TR); Orientation: Horizontal; Manufacturer Part Number: SJ-3523-SMT-TR; Octopart URL: https://octopart.com/sj-3523-smt-tr-cui-25947224; Mounting Style: Surface Mount; RoHS: Compliant; OctopartID: 9d6655e7545842a1; Color: Black
J8 = CMP-d3711b49a5340cb6-2: Conn Audio RCP 5 POS Solder ST Thru-Hole 5 Terminal 1 Port; Gender: Female; RoHS: Compliant; Octopart URL: https://octopart.com/stx-3790-5n-kycon-20075299; OctopartID: d3711b49a5340cb6; Packaging: Tray; Mounting Style: Through Hole; Manufacturer Part Number: STX-3790-5N; Color: Black
J9 = CMP-qu24ppwf8ue4q4dth5co-2: 3.5mm Plug-in headphone holder; CustomComponentID: qu24ppwf8ue4q4dth5co; Manufacturer Part Number: PJ-3059-X
J10 = CMP-77b5bebc9fe3a872-2: Molex; SER Number 53290; 2mm Pitch 4Way 1Row Straight PCB Header; Solder Term; 1.5A; Mated Height: 6.00 mm; Gender: Male; Number of Contacts: 4; Current Rating: 1.50 A; Number of Circuits: 3, 4; Lead-Free Status: Lead Free; Pin Pitch: 2.00 mm; Glow Wire Compliant: Non-Compliant; Number of Rows: 1; Lifecycle Status: Active; OctopartID: 77b5bebc9fe3a872; Mounting Style: Through Hole; Size-Height: 6.00 mm; Size-Width: 3.70 mm; Operating Temperature: 105 °C (max); Octopart URL: https://octopart.com/53290-0480-molex-249136; Packaging: Bulk; RoHS: Compliant; Contact Plating: Tin; Halogen Free Status: Not Halogen Free; Manufacturer Part Number: 53290-0480; Number of Positions: 4; Size-Length: 11.0 mm; Orientation: Vertical
J11 = CMP-efff26f6ba583038-1: 2.00mm Pitch Board-to-Board Receptacle, Right Angle, Single Row, Friction Lock, 4 Circuits; Contact Resistance: 20.0 m? (max); Current Rating: 1.50 A; Gender: Female; Glow Wire Compliant: Non-Compliant; Insulation Resistance: 1.00 G? (min); Lead-Free Status: Lead Free; Number of Circuits: 3, 4; Number of Contacts: 4; Octopart URL: https://octopart.com/52418-0410-molex-225473; Manufacturer Part Number: 52418-0410; Contact Material: Phosphor Bronze; Contact Plating: Tin; Flammability Rating: UL 94 V-0; Halogen Free Status: Not Low Halogen; Housing Material: Plastic; Lifecycle Status: Active; Mounting Style: Through Hole; Number of Positions: 4; Number of Rows: 1; Operating Temperature: 105 °C (max); Orientation: Right Angle; Packaging: Tray; Pin Pitch: 2.00 mm; REACH SVHC Compliance: No SVHC; RoHS: Compliant; Size-Height: 3.15 mm; Size-Length: 9.50 mm; Size-Width: 4.00 mm; OctopartID: efff26f6ba583038
R25 R26 R35 R37 R38 R40 R54 = CMP-4716590-9: Manufacturer Part Number: ERJ-3GEYJ101V; Octopart Url: https://octopart.com/crcw060310k0fkeahp-vishay-42634028; package: 0603; Resistance: 10k; Tolerance: 1%
R27-R29 R34 R39 = CMP-3655986-6: Resistance: 30k; Tolerance: 1%; package: 0603
R30-R33 = CMP-a61f6f36030f79d8-4: as R48 on sheet Power_management; REACH SVHC Compliance: No SVHC; Packaging: Tape & Reel (TR), Cut Tape (CT); Resistance Tolerance: ±1%; Resistance: 1k; RoHS: Compliant; Mounting Style: Surface Mount; Number of Pins: 2; Size-Length: 1.60 mm; Octopart URL: https://octopart.com/cr0603-fx-1001elf-bourns-2326646; Size-Thickness: 457 µm; OctopartID: a61f6f36030f79d8; Size-Width: 787 µm; Case/Package: 0603
R36 = CMP-0de3c699ccb2d224-2: Res Thick Film 1.6 x 0.8 mm 330K Ohm 1% 0.1W(1/10W) 100ppm/ C Molded SMD Paper T/R; Manufacturer Part Number: RC0603FR-07330KL; Resistance: 330 kΩ; Lead-Free Status: Lead Free; OctopartID: 0de3c699ccb2d224; Size-Length: 1.60 mm; Number of Pins: 2; Size-Width: 800 µm; Resistance Tolerance: ±1%
SW1 = CMP-7675167-7: 12 mm Incremental Encoder, 24 Detent, -30 to 70 degC, 5-Pin THD, RoHS, Bulk; Number of Detents: 24; Size-Length: 13.4 mm; Seller Landing  Url: https://octopart.com/click/track?country=US&ak=8157f166&sig=0be53b6&sid=1106&ppid=26648293&vpid=76310724&ct=offers; Manufacturer Part Number: PEC11R-4215F-S0024; ComponentLink2Description: Datasheet; Octopart Url: http://octopart.com/pec11r-4215f-s0024-bourns-26648293; ComponentLink1URL: http://www.bourns.com/; RoHS: Compliant; ComponentLink1Description: Manufacturer URL; PackageReference: PEC11R-4XXXF-SXXXX; PackageDescription: 5-Pin Through Hole Device, Body 12.5 x 13.4 mm; Size-Width: 12.5 mm; OctopartID: f33f3ba348bc2cf8; DatasheetVersion: Jul-14; ComponentLink2URL: http://www.bourns.com/docs/Product-Datasheets/PEC11R.pdf; REACH SVHC Compliance: No SVHC
U4 U5 = CMP-1319549-4: Microchip MCP6L02T-E/MS, Dual Op Amp, 1MHz Rail-Rail, 1.8 to 6 V, 8-Pin MSOP
U6 = CMP-1600df74f371c9c7-1: Ambient Light Sensor Photodetector 6-Pin SMD T/R; Output Current: 40.0 A; Peak Wavelength: 565 nm; Lifecycle Status: Not Listed by Manufacturer; Manufacturer Part Number: APDS-9008-020; OctopartID: 1600df74f371c9c7; RoHS: Compliant; Octopart URL: http://octopart.com/apds-9008-020-avago-8306711
U7 = CMP-a59169e1f8d67a56-4: Humidity & Temperature Sensor ±2% RH ±0, 2°C I2C DFN4; OctopartID: a59169e1f8d67a56

## Sheet uC.SchDoc: uC
size A3; SheetNumber: 4
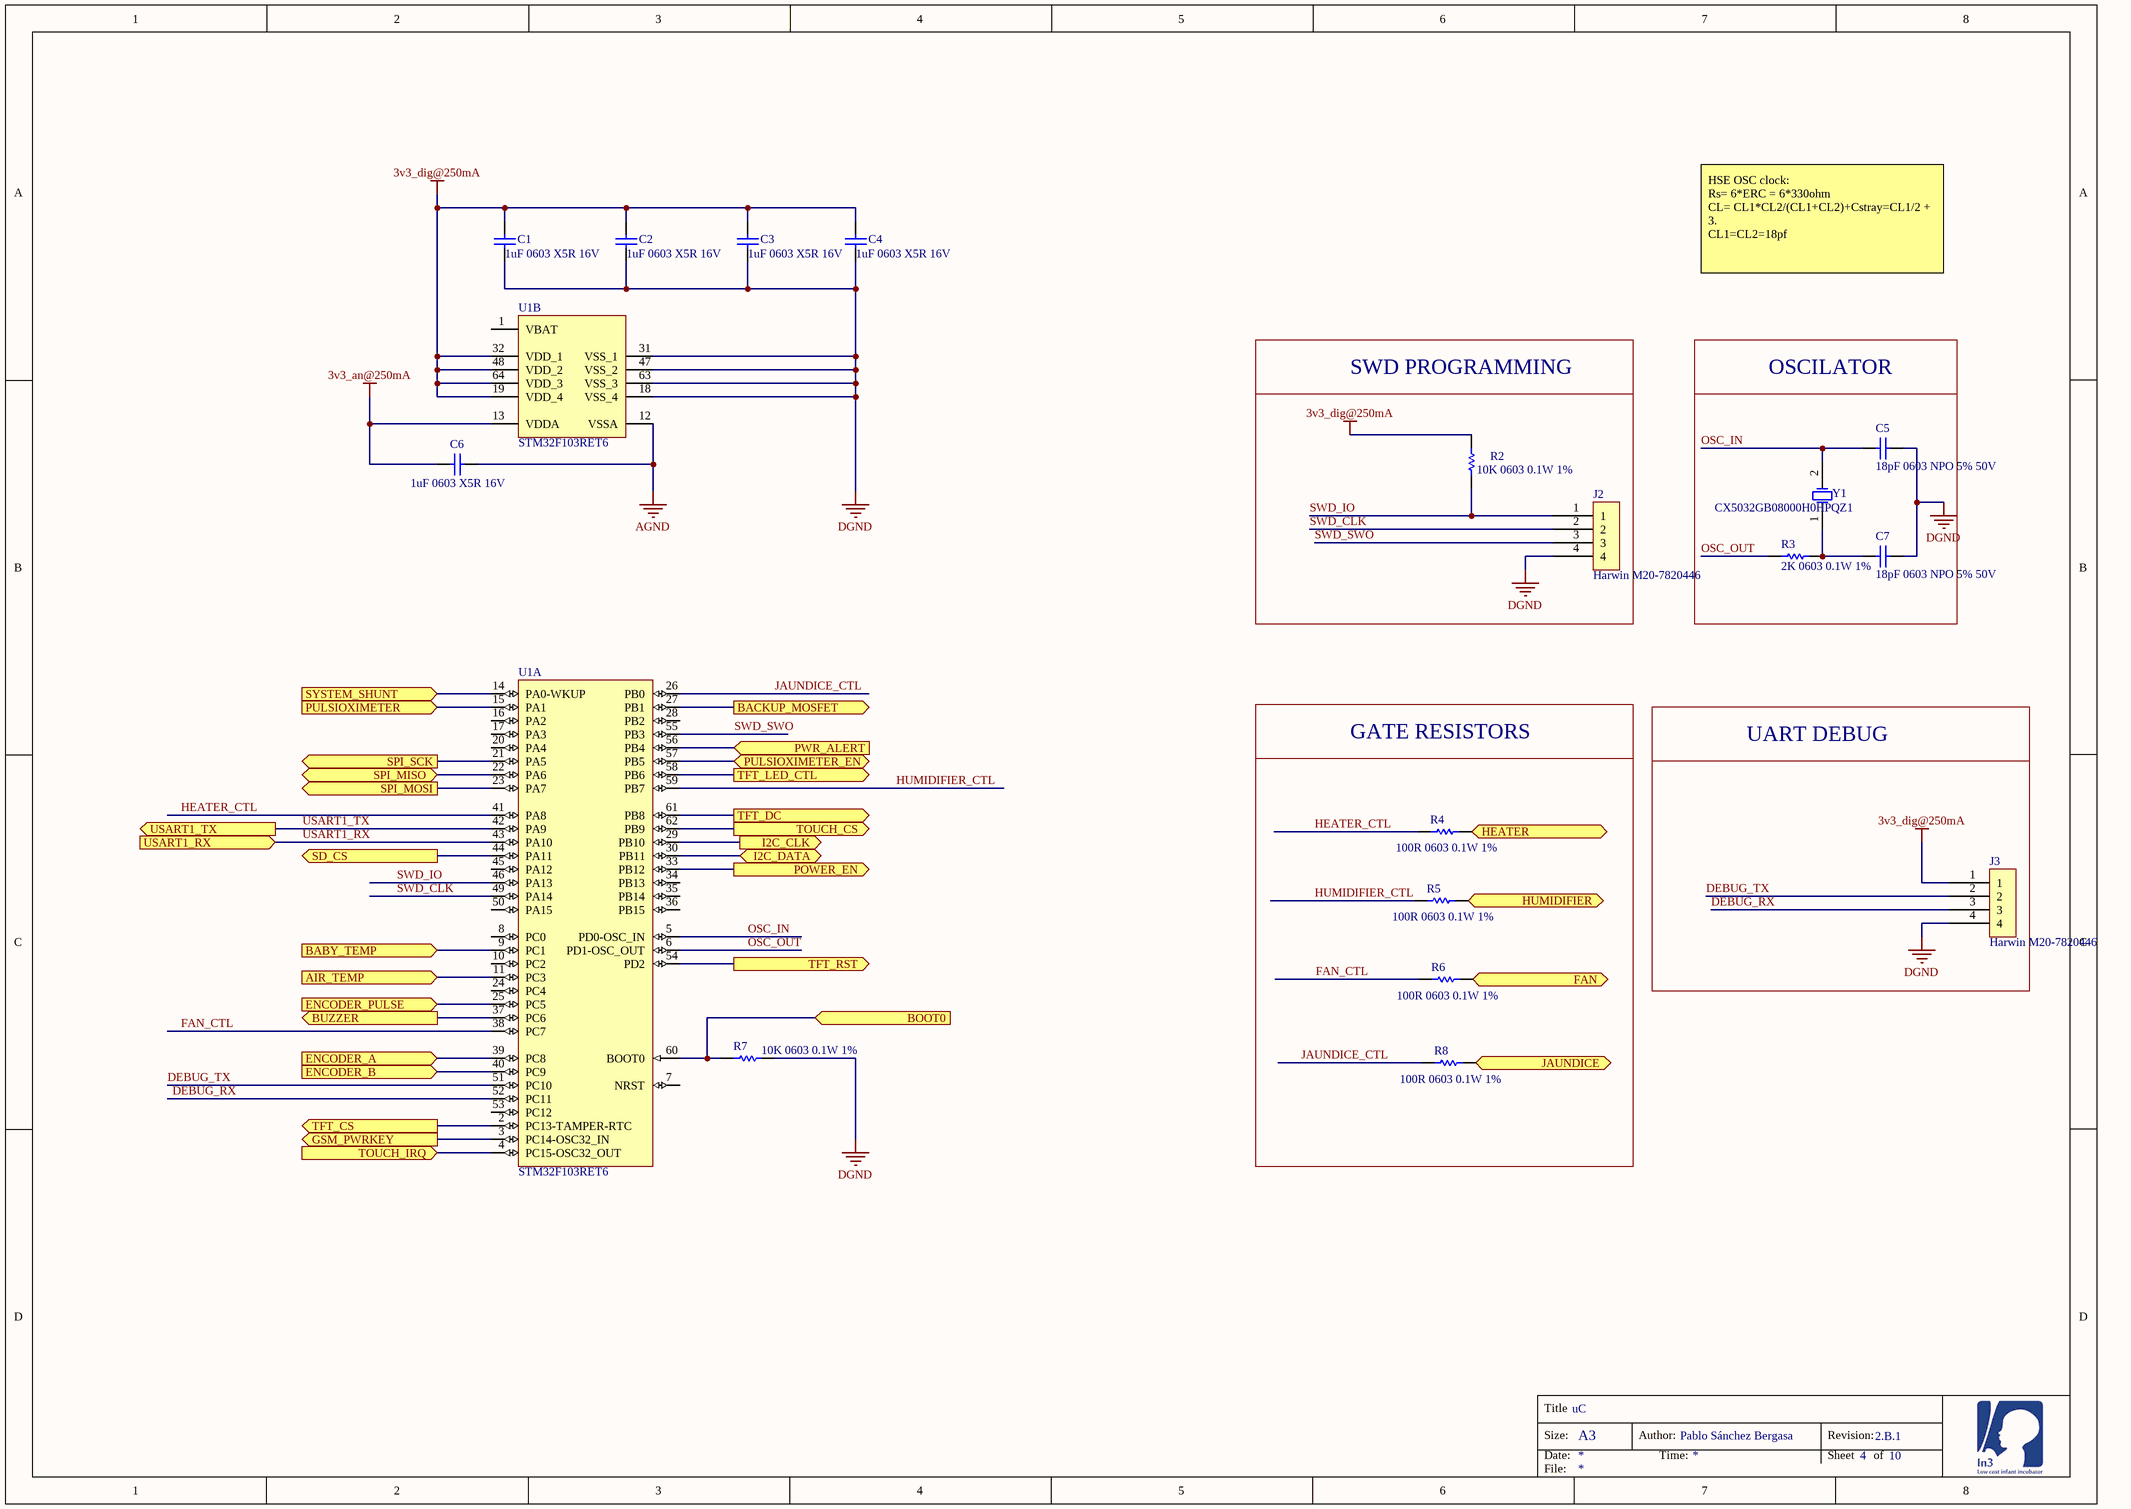
[diagram p4: uC.SchDoc]

### Parts
(Parts that share a designator on the sheet are numbered #1, #2 ... from top to bottom, then left to right.)
C1  1uF 0603 X5R 16V  [CAPC1608X60X35NL10T15]
C2  1uF 0603 X5R 16V  [CAPC1608X60X35NL10T15]
C3  1uF 0603 X5R 16V  [CAPC1608X60X35NL10T15]
C4  1uF 0603 X5R 16V  [CAPC1608X60X35NL10T15]
C5  18pF 0603 NPO 5% 50V  [CAPC1608X60X35NL10T15]
C6  1uF 0603 X5R 16V  [CAPC1608X60X35ML10T15]
C7  18pF 0603 NPO 5% 50V  [CAPC1608X60X35NL10T15]
J2  Harwin M20-7820446  [PCB-tt6oa92k1i3euqam155k-1]
J3  Harwin M20-7820446  [PCB-tt6oa92k1i3euqam155k-1]
R2  10K 0603 0.1W 1%  [RESC1609X55X30ML10T20]
R3  2K 0603 0.1W 1%  [RESC1609X55X30ML10T20]
R4  100R 0603 0.1W 1%  [RESC1609X55X30ML10T20]
R5  100R 0603 0.1W 1%  [RESC1609X55X30ML10T20]
R6  100R 0603 0.1W 1%  [RESC1609X55X30ML10T20]
R7  10K 0603 0.1W 1%  [RESC1609X55X30ML10T20]
R8  100R 0603 0.1W 1%  [RESC1609X55X30ML10T20]
U1#1  STM32F103RET6  [STM-LQFP64_L]  (part B of 2)
U1#2  STM32F103RET6  [STM-LQFP64_L]  (part A of 2)
Y1  CX5032GB08000H0HPQZ1  [PCB-mm1uo60gbc5oxcl0fq61-1]

### Blocks framed on the sheet
SWD PROGRAMMING: J2 R2
OSCILATOR: C5 C7 R3 Y1
GATE RESISTORS: R4-R6 R8
UART DEBUG: J3

### Ports
AIR_TEMP (in), BABY_TEMP (in), BACKUP_MOSFET (out), BOOT0 (in), BUZZER (out), ENCODER_A (in), ENCODER_B (in), ENCODER_PULSE (in), FAN (out), GSM_PWRKEY (out), HEATER (out), HUMIDIFIER (out), I2C_CLK (out), I2C_DATA (bidir), JAUNDICE (out), POWER_EN (out), PULSIOXIMETER (in), PULSIOXIMETER_EN, PWR_ALERT (in), SD_CS (out), SPI_MISO, SPI_MOSI (out), SPI_SCK (out), SYSTEM_SHUNT (in), TFT_CS (out), TFT_DC (out), TFT_LED_CTL (out), TFT_RST (out), TOUCH_CS (out), TOUCH_IRQ (in), USART1_RX (in), USART1_TX (out)

### Nets
3v3_an@250mA: C6.1 U1#1.13(VDDA)
3v3_dig@250mA: C1.1 C2.1 C3.1 C4.1 J3.1 R2.1 U1#1.19(VDD_4) U1#1.32(VDD_1) U1#1.48(VDD_2) U1#1.64(VDD_3)
3v3_pulsioximeter: U1#2.57(PB5) ; port PULSIOXIMETER_EN
AGND: C6.2 U1#1.12(VSSA)
DGND: C1.2 C2.2 C3.2 C4.2 C5.2 C7.2 J2.4 J3.4 R7.2 U1#1.18(VSS_4) U1#1.31(VSS_1) U1#1.47(VSS_2) U1#1.63(VSS_3)
DEBUG_RX: J3.3 U1#2.52(PC11)
DEBUG_TX: J3.2 U1#2.51(PC10)
FAN_CTL: R6.2 U1#2.38(PC7)
HEATER_CTL: R4.2 U1#2.41(PA8)
HUMIDIFIER_CTL: R5.2 U1#2.59(PB7)
JAUNDICE_CTL: R8.2 U1#2.26(PB0)
OSC_IN: C5.1 U1#2.5(PD0-OSC_IN) Y1.2(OSC2)
OSC_OUT: R3.2 U1#2.6(PD1-OSC_OUT)
PULSIOXIMETER_: U1#2.15(PA1) ; port PULSIOXIMETER
SCL: U1#2.29(PB10) ; port I2C_CLK
SD_CS: U1#2.44(PA11) ; port SD_CS
SDA: U1#2.30(PB11) ; port I2C_DATA
SPI_MISO: U1#2.22(PA6) ; port SPI_MISO
SPI_MOSI: U1#2.23(PA7) ; port SPI_MOSI
SPI_SCK: U1#2.21(PA5) ; port SPI_SCK
SWD_CLK: J2.2 U1#2.49(PA14)
SWD_IO: J2.1 R2.2 U1#2.46(PA13)
SWD_SWO: J2.3 U1#2.55(PB3)
SYS_CURRENT: U1#2.14(PA0-WKUP) ; port SYSTEM_SHUNT
TFT_CS: U1#2.2(PC13-TAMPER-RTC) ; port TFT_CS
TFT_DC: U1#2.61(PB8) ; port TFT_DC
TFT_LED_CTL: U1#2.58(PB6) ; port TFT_LED_CTL
TFT_RST: U1#2.54(PD2) ; port TFT_RST
TOUCH_CS: U1#2.62(PB9) ; port TOUCH_CS
TOUCH_IRQ: U1#2.4(PC15-OSC32_OUT) ; port TOUCH_IRQ
USART1_RX: U1#2.43(PA10) ; port USART1_RX  [project net GSM_TX]
USART1_TX: U1#2.42(PA9) ; port USART1_TX  [project net GSM_RX]
NetC7_1: C7.1 R3.1 Y1.1(OSC1)
NetC17_1: U1#2.9(PC1) ; port BABY_TEMP
NetC18_2: U1#2.40(PC9) ; port ENCODER_B
NetC19_2: U1#2.39(PC8) ; port ENCODER_A
NetC20_2: U1#2.25(PC5) ; port ENCODER_PULSE
NetC34_1: U1#2.11(PC3) ; port AIR_TEMP
NetQ2_1: R4.1 ; port HEATER
NetQ3_1: R5.1 ; port HUMIDIFIER
NetQ4_1: R6.1 ; port FAN
NetQ5_1: R8.1 ; port JAUNDICE
NetQ6_1: U1#2.27(PB1) ; port BACKUP_MOSFET
NetR7_1: R7.1 U1#2.60(BOOT0) ; port BOOT0
NetR13_1: U1#2.3(PC14-OSC32_IN) ; port GSM_PWRKEY
NetR44_2: U1#2.37(PC6) ; port BUZZER
NetR48_1: U1#2.33(PB12) ; port POWER_EN
NetU1#2_56: U1#2.56(PB4) ; port PWR_ALERT

Not connected (* = marked no-connect by the designer): U1#1 1(VBAT); U1#2 7(NRST) 8(PC0) 10(PC2) 16(PA2) 17(PA3) 20(PA4) 24(PC4) 28(PB2) 34(PB13) 35(PB14) 36(PB15) 45(PA12) 50(PA15) 53(PC12)

### Notes on the sheet
- HSE OSC clock:
  Rs= 6*ERC = 6*330ohm
  CL= CL1*CL2/(CL1+CL2)+Cstray=CL1/2 + 3.
  CL1=CL2=18pf
- Title
- Size:
- Date:
- A3
- Author:
- Time:
- Revision:
- Sheet
- of
- File:

### Library data of the parts
C1-C4 C6 = CMP-119984-2: as C17 on sheet Sensors; Capacitance: 1uF; Dielectric Characteristic: X5R; Lifecycle Status: Active; Mounting Style: Surface Mount; Number of Pins: 2; Octopart Url: https://octopart.com/grm185r61c105ke44d-murata-197446; OctopartID: de3e1737f81e01f9; REACH SVHC Compliance: No SVHC; RoHS: Compliant; Size-Height: 0.0005 m; Size-Length: 0.0016 m; Size-Thickness: 0.0005 m; Size-Width: 0.0008 m; Rated voltage: 16V
C5 C7 = CMP-35cbf9f8b0acea0c-1: as C12 on sheet GSM; Octopart URL: https://octopart.com/c0603c180k5racauto-kemet-87662593; Case/Package: 0603; Mounting Style: Surface Mount; Operating Temperature: -55.0 °C (min); RoHS: Compliant; OctopartID: 35cbf9f8b0acea0c
J2 J3 = CMP-2481958-5: Conn Socket Strip SKT 4 POS 2.54mm Solder ST Thru-Hole Tube; Number of Contacts: 4; Current Rating: 3.00 A; Insulation Resistance: 1.00 MΩ; Number of Mating Cycles: 50; Gender: Female; Contact Resistance: 15.0 mΩ; Contact Material: Phosphor Bronze; Number of Rows: 1; OctopartID: 0d9ac4c1d3c6d25d; Pin Pitch: 2.54 mm; Octopart URL: http://octopart.com/m20-7820446-harwin-5372730; RoHS: Compliant; REACH SVHC Compliance: No SVHC; Contact Plating: Tin; Mounting Style: Through Hole, Vertical; Manufacturer Part Number: M20-7820446; DNP: DNP
R2 R7 = CMP-4716590-9: Octopart Url: https://octopart.com/crcw060310k0fkeahp-vishay-42634028; package: 0603; Resistance: 10k; Tolerance: 1%
R3 = CMP-3655986-6: Resistance: 2K; Tolerance: 1%; package: 0603
R4-R6 R8 = CMP-a61f6f36030f79d8-4: as R16 on sheet GSM; REACH SVHC Compliance: No SVHC; Packaging: Tape & Reel (TR), Cut Tape (CT); Resistance Tolerance: ±1%; RoHS: Compliant; Mounting Style: Surface Mount; Number of Pins: 2; Size-Length: 1.60 mm; Octopart URL: https://octopart.com/cr0603-fx-1001elf-bourns-2326646; Size-Thickness: 457 µm; OctopartID: a61f6f36030f79d8; Size-Width: 787 µm; Case/Package: 0603
U1#1 U1#2 = CMP-2386707-4: ARM Cortex-M3 32-bit MCU, 512 KB Flash, 64 KB Internal RAM, 51 I/Os, 64-pin LQFP, -40 to 85 degC, Tray; Clock Speed: 72000000.0 Hz; FLASH Memory Size: 524288 B; Lead-Free Status: Lead Free; Number of Bits: 32; RAM Memory Size: 65536 B; Lifecycle Status: Active; Mounting Style: Surface Mount; Number of Pins: 64; Octopart Url: https://octopart.com/stm32f103ret6-stmicroelectronics-8119628; OctopartID: bab873c97a92657f; REACH SVHC Compliance: No SVHC; RoHS: Compliant
Y1 = CMP-4fdd8615a0ef901a-1: Crystal 8Mhz 30ppm -40ºC/+85ºC 12pF 300ohm; Manufacturer Part Number: CX5032GB08000H0HPQZ1; Packaging: Reel; Mounting Style: Surface Mount

## Sheet Power_Input.SchDoc: Power input
size A4; SheetNumber: 2
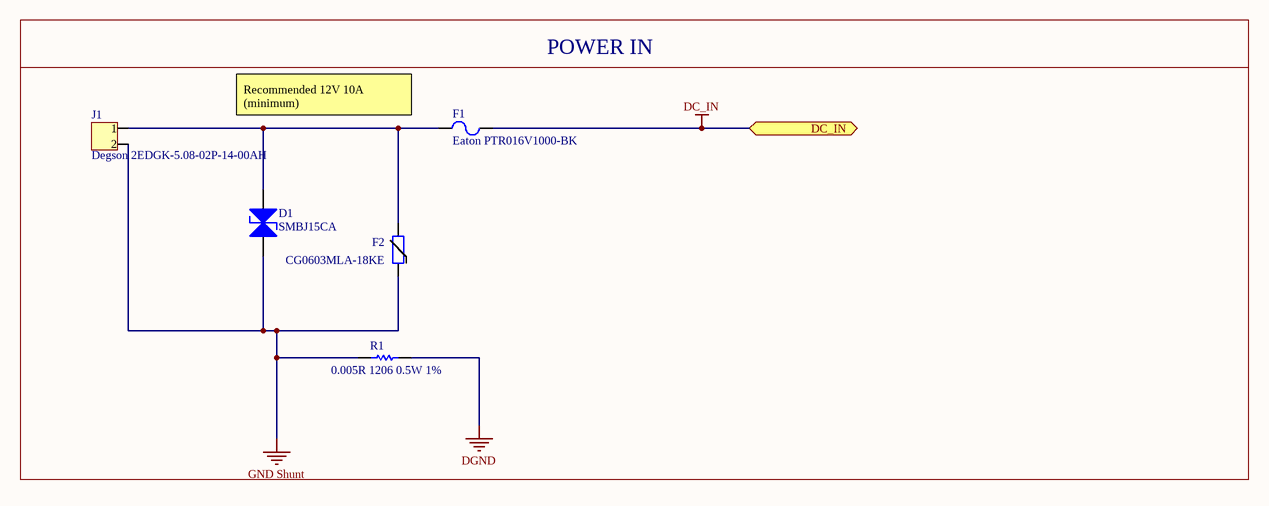
[diagram p5: Power_Input.SchDoc]

### Parts
D1  SMBJ15CA  [PCB-acsqsz06h0bi34fqghyj-1]
F1  Eaton PTR016V1000-BK  [PCB-m5opblue4hjll7k5rrhf-1]
F2  CG0603MLA-18KE  [CAPC1608X60X35NL10T15]
J1  Degson 2EDGK-5.08-02P-14-00AH  [PCB-h4cyb3wxd4gf7j132tzl-1]
R1  0.005R 1206 0.5W 1%  [CAPC3216X180X55ML20T25]

### Blocks framed on the sheet
POWER IN: D1 F1 F2 J1 R1

### Ports
DC_IN

### Nets
DC_IN: F1.2 ; port DC_IN
DGND: R1.1
GND Shunt: D1.1(A) F2.1 J1.2 R1.2
NetD1_2: D1.2(K) F1.1 F2.2 J1.1

### Notes on the sheet
- (near F1) Recommended 12V 10A (minimum)
- Title
- Size:
- Date:
- A3
- Author:
- Time:
- Revision:
- Sheet
- of
- File:

### Library data of the parts
D1 = CMP-f09b39914f642f5c-1: SMBJ15 Series 24.4 V 600 W Bi-Directional Transient Voltage Suppressor-DO-214AA; Power Dissipation: 5.00 W; Breakdown Voltage: 16.7 V; Power Rating: 600 W; Octopart URL: http://octopart.com/smbj15ca-littelfuse-39577; Mounting Style: Surface Mount; RoHS: Compliant
F1 = CMP-97bc5de44104487b-2: PTC Resettable Fuse 10A(hold) 17A(trip) 16VDC 100A 3.6W 6s 0.004Ohm Radial 16.5 X 3.1 X 25.2mm Bag; OctopartID: 97bc5de44104487b; Manufacturer Part Number: PTR016V1000-BK; Octopart URL: https://octopart.com/ptr016v1000-bk-eaton-55768030; Packaging: Bag; Mounting Style: Through Hole; RoHS: Compliant
F2 = CMP-c3730a7940881cb4-1: Var MOV 14VAC 18VDC 30A 24.2V 0603 SMD Paper T/R Var MOV 14VAC 18VDC 30A 24.2V 0603 SMD Paper T/R; Capacitance: 140 pF; Operating Voltage: 14.0 V; Voltage Rating (DC): 18.0 V; Octopart URL: https://octopart.com/cg0603mla-18ke-bourns-42653; Manufacturer Part Number: CG0603MLA-18KE; Case/Package: 0603; Mounting Style: Surface Mount, Solder; Operating Temperature: -55.0 °C (min); Packaging: Reel; REACH SVHC Compliance: No SVHC; RoHS: Compliant; Size-Height: 813 µm; Size-Length: 1.63 mm; Size-Width: 813 µm; Voltage Rating (AC): 14.0 V; OctopartID: c3730a7940881cb4
J1 = CMP-7a42b7ee166ba585-1: Terminal block, 5mm 2 Pos, through hole male.; Manufacturer Part Number: 2EDGK-5.08-02P-14-00AH + 2EDGVC-5.08-02P; Octopart URL: https://octopart.com/2edgk-5.08-02p-14-00ah-degson-78006607; OctopartID: 7a42b7ee166ba585; Manufacturer Part Number 2: WJ2EDGVC-5.08-2P + WJ2EDGK-5.08-2P
R1 = CMP-0abdc173b10ad57a-1: Manufacturer Part Number: WSLP12065L000FEA; Resistance: 0,024; Power: 1W; Octopart URL: https://octopart.com/1-2176055-0-te+connectivity-46440145; Case/Package: 1206; Lifecycle Status: Not Listed by Manufacturer; Packaging: Tape & Reel (TR); OctopartID: 0abdc173b10ad57a; OrderingCode: WSLP12065L000FEA; Manufacturer Part Number 2: FMF06FTHR005-LHL

## Sheet Actuators.SchDoc: Actuators
size A3; SheetNumber: 6
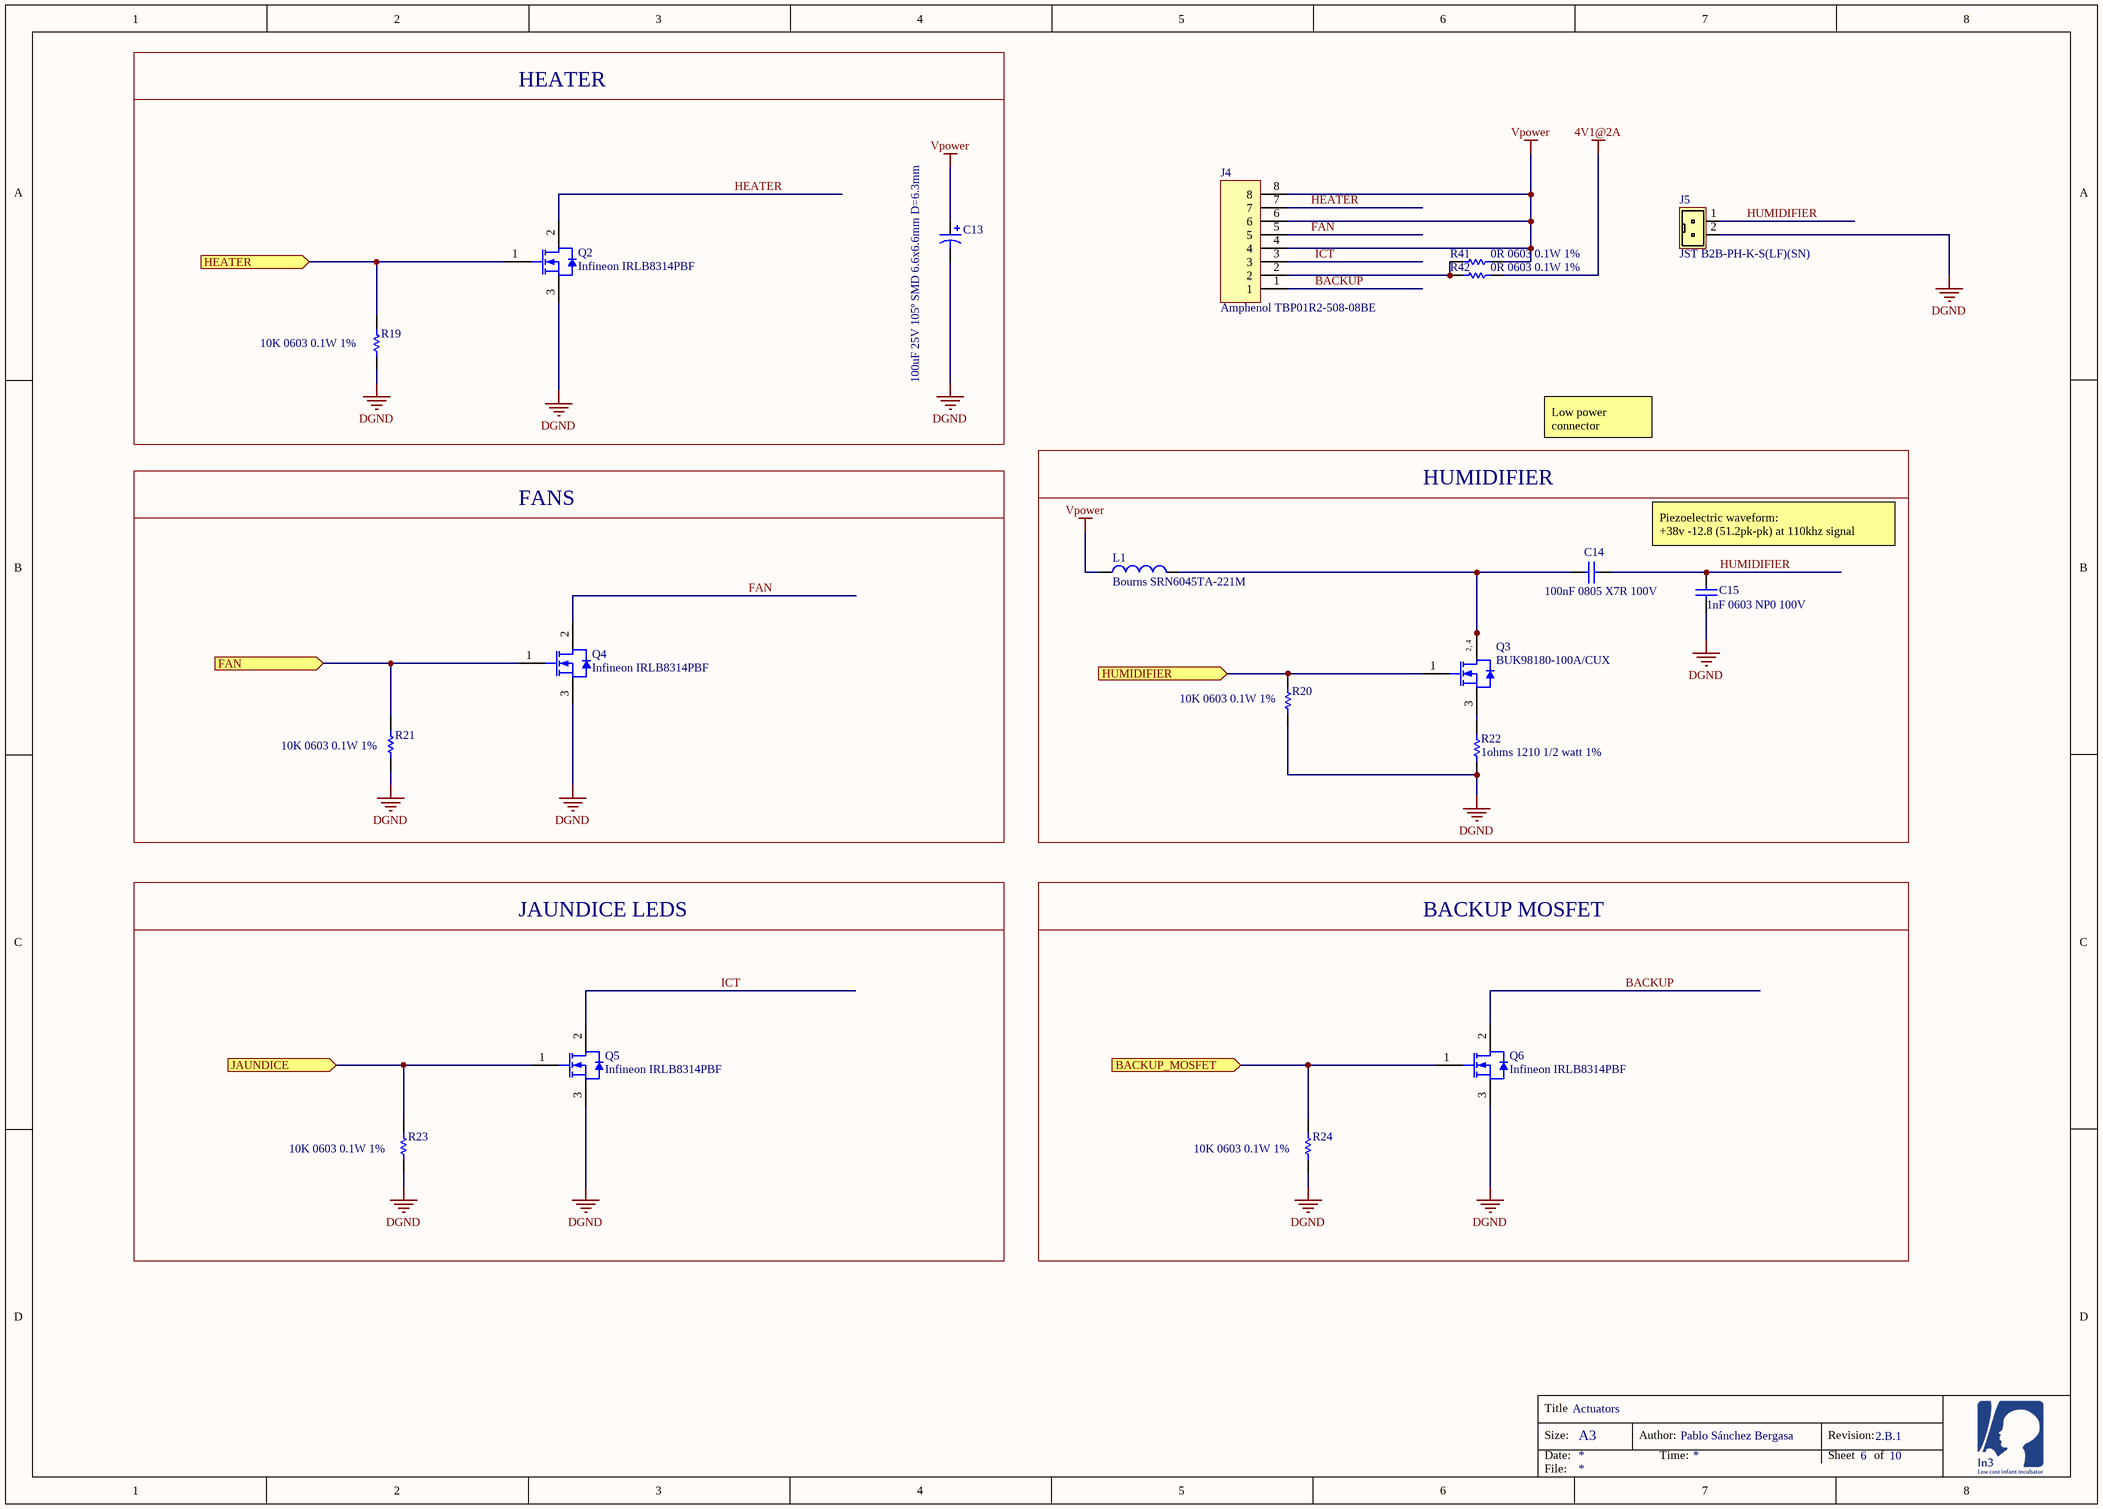
[diagram p6: Actuators.SchDoc]

### Parts
C13  100uF 25V 105º SMD 6.6x6.6mm D=6.3mm  [PCB-5eg0a5nygcrzw5ibm1j9-1]
C14  100nF 0805 X7R 100V  [CAPC2013X110X50ML20T25]  (no BOM)
C15  1nF 0603 NP0 100V  [CAPC1608X60X35NL10T15]  (no BOM)
J4  Amphenol TBP01R2-508-08BE  [PCB-9bbxoaz61thsmuxn7f5e-1]
J5  JST B2B-PH-K-S(LF)(SN)  [PCB-so191l03tuzsl9xcnbls-1]
L1  Bourns SRN6045TA-221M  [PCB-wv16t2tzy3vtnr72ahin-1]  (no BOM)
Q2  Infineon IRLB8314PBF  [PCB-s29nlaacffy4qzcyhtz9-1]
Q3  BUK98180-100A/CUX  [NXP-SOT223_L]  (no BOM)
Q4  Infineon IRLB8314PBF  [PCB-s29nlaacffy4qzcyhtz9-1]
Q5  Infineon IRLB8314PBF  [PCB-s29nlaacffy4qzcyhtz9-1]
Q6  Infineon IRLB8314PBF  [PCB-s29nlaacffy4qzcyhtz9-1]
R19  10K 0603 0.1W 1%  [RESC1609X55X30ML10T20]
R20  10K 0603 0.1W 1%  [RESC1609X55X30ML10T20]  (no BOM)
R21  10K 0603 0.1W 1%  [RESC1609X55X30ML10T20]
R22  1ohms 1210 1/2 watt 1%  [RESC3225X60X45NL20T20]  (no BOM)
R23  10K 0603 0.1W 1%  [RESC1609X55X30ML10T20]
R24  10K 0603 0.1W 1%  [RESC1609X55X30ML10T20]
R41  0R 0603 0.1W 1%  [RESC1609X55X30ML10T20]  (no BOM)
R42  0R 0603 0.1W 1%  [RESC1609X55X30ML10T20]

### Blocks framed on the sheet
HEATER: C13 Q2 R19
HUMIDIFIER: C14 C15 L1 Q3 R20 R22
FANS: Q4 R21
JAUNDICE LEDS: Q5 R23
BACKUP MOSFET: Q6 R24

### Ports
BACKUP_MOSFET (in), FAN (in), HEATER (in), HUMIDIFIER (in), JAUNDICE (in)

### Nets
4V1@2A: R42.2
DGND: C13.2 C15.2 J5.2 Q2.3(S) Q4.3(S) Q5.3(S) Q6.3(S) R19.1 R20.1 R21.1 R22.1 R23.1 R24.1
Vpower: C13.1 J4.4 J4.6 J4.8 L1.1 R41.2
BACKUP: J4.1 Q6.2(D)
FAN: J4.5 Q4.2(D)
HEATER: J4.7 Q2.2(D)
HUMIDIFIER: C14.2 C15.1 J5.1
ICT: J4.3 Q5.2(D)
NetC14_1: C14.1 L1.2 Q3.2(D) Q3.4(D)
NetJ4_2: J4.2 R41.1 R42.1
NetQ2_1: Q2.1(G) R19.2 ; port HEATER
NetQ3_1: Q3.1(G) R20.2 ; port HUMIDIFIER
NetQ3_3: Q3.3(S) R22.2
NetQ4_1: Q4.1(G) R21.2 ; port FAN
NetQ5_1: Q5.1(G) R23.2 ; port JAUNDICE
NetQ6_1: Q6.1(G) R24.2 ; port BACKUP_MOSFET

### Notes on the sheet
- Low power connector
- Piezoelectric waveform:
  +38v -12.8 (51.2pk-pk) at 110khz signal
- Title
- Size:
- Date:
- A3
- Author:
- Time:
- Revision:
- Sheet
- of
- File:
- (in symbol CMP-20463525-2) 2, 4

### Library data of the parts
C13 = CMP-a6d16ad512617916-1: as C29 on sheet Power_management; Octopart URL: https://octopart.com/vzl101m1etr-0607-lelon-84840918; OctopartID: a6d16ad512617916; Capacity: 100uF; Voltage rating: 25V
C14 = CMP-3993849-2: CAP, CERAMIC, 0.1UF, 100V, X7R, 0805; Manufacturer Part Number: C0805C104K1RACAUTO; Capacitance: 1e-07 F; Capacitance Tolerance: ±10%; Lead-Free Status: R; Voltage Rating (DC): 100.0 V; Case/Package: 0805; Dielectric Characteristic: X7R; Dielectric Material: Ceramic; Mounting Style: Surface Mount; Octopart Url: https://octopart.com/c0805c104k1racauto-kemet-12625098; OctopartID: 1a32d3f89b9ec5f5; Packaging: Cut Tape (CT); REACH SVHC Compliance: No SVHC; RoHS: Compliant
C15 = CMP-119984-2: 1uF 0603 X5R 16V; Manufacturer Part Number: CC0603JRNPO0BN102; Capacitance Tolerance: ±10%; Case/Package (in): 0603; Lead-Free Status: Lead Free; Capacitance: 1uF; Dielectric Characteristic: X5R; Lifecycle Status: Active; Mounting Style: Surface Mount; Number of Pins: 2; Octopart Url: https://octopart.com/grm185r61c105ke44d-murata-197446; OctopartID: de3e1737f81e01f9; REACH SVHC Compliance: No SVHC; RoHS: Compliant; Size-Height: 0.0005 m; Size-Length: 0.0016 m; Size-Thickness: 0.0005 m; Size-Width: 0.0008 m; Rated voltage: 16V
J4 = CMP-fe5c33832e0f219b-3: Term Block Hdr 8POS 90DEG 5.08MM; Manufacturer Part Number: TBP01R2-508-08BE + TBP01P1-508-08BE; Mating connector: TBP01P1-508-08BE; OctopartID: fe5c33832e0f219b; Manufacturer Part Number 2: WJ2EDGVC-5.08-8P + KF2EDGK-5.08-8P
J5 = CMP-642947-25: Connector Header, PH Series, 2 Position, 2.00mm, Through Hole, Press-Fit, Solder, Natural; Voltage Rating (AC): 100 V; Lead-Free Status: Lead Free; Number of Contacts: 2; Housing Material: Nylon; Manufacturer Part Number: B2B-PH-K-S(LF)(SN); RoHS: Compliant; OctopartID: a21c6b154b5e7ddb; Housing Color: Natural; Packaging: Bulk; Operating Temperature: 85.0 °C (max)
L1 = CMP-d1e61c97cd460e21-1: Inductor Power Semi-Shielded Wirewound 220uH 20% 1MHz 15Q-Factor Ferrite 0.6A 0.9Ohm DCR 2424 Automotive T/R; Inductance: 220 µH; Octopart URL: https://octopart.com/srn6045ta-221m-bourns-75184582; Manufacturer Part Number: SRN6045TA-221M; Packaging: Cut Tape (CT); RoHS: Compliant; OctopartID: d1e61c97cd460e21; Manufacturer Part Number 2: SWPA6045S221MT
Q2 Q4-Q6 = CMP-b9737394b7fb66b4-2: Trans MOSFET N-CH 30V 171A 3-Pin(3+Tab) TO-220AB Tube
Q3 = CMP-20463525-2: N-Channel TrenchMOS Logic Level FET, 100 V, 4.6 A, 4-Pin SOT223, Tape and Reel; Manufacturer Part Number: BUK98180-100A/CUX; Lifecycle Status: Active; Octopart Url: https://octopart.com/buk98180-100a%2Fcux-nxp+semiconductors-30937972; OctopartID: 0bbbc3693da9d47c
R19-R21 R23 R24 = CMP-4716590-9: Octopart Url: https://octopart.com/crcw060310k0fkeahp-vishay-42634028; package: 0603; Resistance: 10k; Tolerance: 1%
R22 = CMP-1870171-2: Thick Film Resistors - SMD 3/4watt 1ohms 1%; Manufacturer Part Number: ERJ14YJ1R0U; Lead-Free Status: Lead Free; Power Rating: 0.5 W; Resistance: 1.0 Ω; Case/Package: 1210; Octopart Url: https://octopart.com/crcw12101r00fkeahp-vishay+dale-44516502; OctopartID: 16f4dd597704c933; Resistance Tolerance: ±1%; RoHS: Compliant
R41 R42 = CMP-536b9a7387ce8cac-10: HelpURL: http://www.yageo.com/documents/recent/PYu-RC_Group_51_RoHS_L_9.pdf; Resistance: 0R; package: 0603

## Sheet Buzzer.SchDoc: Buzzer
size A4; SheetNumber: 9
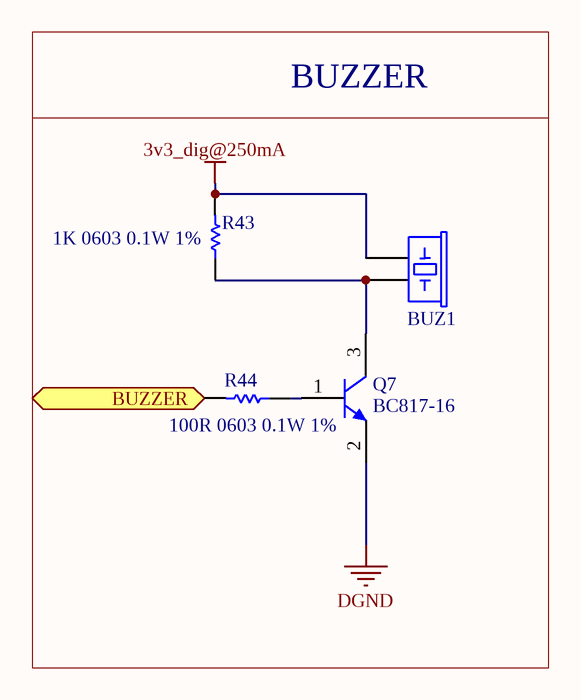
[diagram p7: Buzzer.SchDoc]

### Parts
BUZ1  CUI CMT-1285C-035  [BUZZER-12MM-NS]  (value not drawn)
Q7  BC817-16  [PCB-856332-1]
R43  1K 0603 0.1W 1%  [RESC1609X55X30ML10T20]
R44  100R 0603 0.1W 1%  [RESC1609X55X30ML10T20]

### Blocks framed on the sheet
BUZZER: BUZ1 Q7 R43 R44

### Ports
BUZZER (in)

### Nets
3v3_dig@250mA: BUZ1.1(+) R43.2
DGND: Q7.2(E)
NetBUZ1_2: BUZ1.2(-) Q7.3(C) R43.1
NetQ7_1: Q7.1(B) R44.1
NetR44_2: R44.2 ; port BUZZER

### Notes on the sheet
- Title
- Size:
- Date:
- A3
- Author:
- Time:
- Revision:
- Sheet
- of
- File:

### Library data of the parts
BUZ1 = CMP-581a9557be5887dd-1: Audio Buzzer Magnetic 3Vo-p 5Vo-p 70mA 3.5Vo-p 85dB Through Hole Pin Tray; Lead-Free Status: Lead Free; Octopart URL: https://octopart.com/cmt-1285c-035-cui-71811876; Manufacturer Part Number: CMT-1285C-035; Mounting Style: Through Hole; RoHS: Compliant; OctopartID: 581a9557be5887dd; Manufacturer Part Number 2: GMC1205YA-16R2048
Q7 = CMP-856332-3: as Q10 on sheet Power_management; Case/Package: SOT-23; Lifecycle Status: Active; Mounting Style: Surface Mount; Number of Pins: 3; Octopart Url: https://octopart.com/mmbt2222a-7-f-diodes+inc.-357838; OctopartID: 53a79aa8030f8c60; Packaging: Cut Tape (CT); Polarity: NPN; REACH SVHC Compliance: No SVHC; RoHS: Compliant
R43 = CMP-a61f6f36030f79d8-4: as R48 on sheet Power_management; REACH SVHC Compliance: No SVHC; Packaging: Tape & Reel (TR), Cut Tape (CT); Resistance Tolerance: ±1%; Resistance: 1k; RoHS: Compliant; Mounting Style: Surface Mount; Number of Pins: 2; Size-Length: 1.60 mm; Octopart URL: https://octopart.com/cr0603-fx-1001elf-bourns-2326646; Size-Thickness: 457 µm; OctopartID: a61f6f36030f79d8; Size-Width: 787 µm; Case/Package: 0603
R44 = CMP-a61f6f36030f79d8-4: as R16 on sheet GSM; REACH SVHC Compliance: No SVHC; Packaging: Tape & Reel (TR), Cut Tape (CT); Resistance Tolerance: ±1%; RoHS: Compliant; Mounting Style: Surface Mount; Number of Pins: 2; Size-Length: 1.60 mm; Octopart URL: https://octopart.com/cr0603-fx-1001elf-bourns-2326646; Size-Thickness: 457 µm; OctopartID: a61f6f36030f79d8; Size-Width: 787 µm; Case/Package: 0603

## Sheet Screen.SchDoc: Screen
size A4; SheetNumber: 10
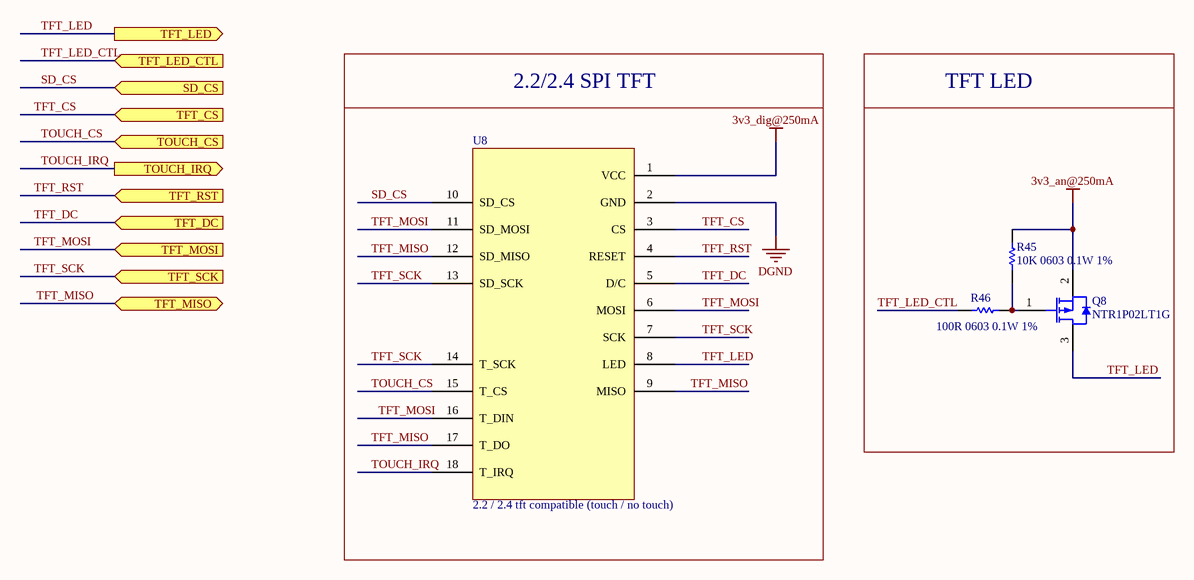
[diagram p8: Screen.SchDoc]

### Parts
Q8  NTR1P02LT1G  [ONSC-SOT-23-3-318-08_V]
R45  10K 0603 0.1W 1%  [RESC1609X55X30ML10T20]
R46  100R 0603 0.1W 1%  [RESC1609X55X30ML10T20]
U8  2.2 / 2.4 tft compatible (touch / no touch)  [PCB-0iq7iyy8nrzrpmpo9lhg-1]

### Blocks framed on the sheet
2.2/2.4 SPI TFT: U8
TFT LED: Q8 R45 R46

### Ports
SD_CS (in), TFT_CS (in), TFT_DC (in), TFT_LED (out), TFT_LED_CTL (in), TFT_MISO, TFT_MOSI (in), TFT_RST (in), TFT_SCK (in), TOUCH_CS (in), TOUCH_IRQ (out)

### Nets
3v3_an@250mA: Q8.2(S) R45.1
3v3_dig@250mA: U8.1(VCC)
DGND: U8.2(GND)
SD_CS: U8.10(SD_CS) ; port SD_CS
TFT_CS: U8.3(CS) ; port TFT_CS
TFT_DC: U8.5(D/C) ; port TFT_DC
TFT_LED: Q8.3(D) U8.8(LED) ; port TFT_LED
TFT_LED_CTL: R46.2 ; port TFT_LED_CTL
TFT_MISO: U8.9(MISO) U8.12(SD_MISO) U8.17(T_DO) ; port TFT_MISO  [project net SPI_MISO]
TFT_MOSI: U8.6(MOSI) U8.11(SD_MOSI) U8.16(T_DIN) ; port TFT_MOSI  [project net SPI_MOSI]
TFT_RST: U8.4(RESET) ; port TFT_RST
TFT_SCK: U8.7(SCK) U8.13(SD_SCK) U8.14(T_SCK) ; port TFT_SCK  [project net SPI_SCK]
TOUCH_CS: U8.15(T_CS) ; port TOUCH_CS
TOUCH_IRQ: U8.18(T_IRQ) ; port TOUCH_IRQ
NetQ8_1: Q8.1(G) R45.2 R46.1

### Notes on the sheet
- Title
- Size:
- Date:
- A3
- Author:
- Time:
- Revision:
- Sheet
- of
- File:

### Library data of the parts
Q8 = CMP-836800-2: Power MOSFET, -20 V, -1.3 A, P-Channel, 3-Pin SOT-23, Pb-Free, Tape and Reel; Current Rating: -1.3 A; Drain to Source Resistance (on) (Rds): 0.22 Ω; Drain to Source Voltage (Vds): -20.0 V; Lead-Free Status: Lead Free; Power Dissipation: 0.4 W; Rise Time: 1.5e-08 s; Manufacturer Part Number: NTR1P02LT1G; Case/Package: SOT-23; Lifecycle Status: Active; Mounting Style: Surface Mount; Octopart Url: https://octopart.com/ntr1p02lt1g-on+semiconductor-341571; OctopartID: 11ecd8e302c9ce2b; Packaging: Tape; Polarity: P-Channel; RoHS: Compliant; Voltage Rating (DC): -20.0 V
R45 = CMP-4716590-9: Manufacturer Part Number: ERJ-3GEYJ101V; Octopart Url: https://octopart.com/crcw060310k0fkeahp-vishay-42634028; package: 0603; Resistance: 10k; Tolerance: 1%
R46 = CMP-a61f6f36030f79d8-4: as R16 on sheet GSM; REACH SVHC Compliance: No SVHC; Packaging: Tape & Reel (TR), Cut Tape (CT); Resistance Tolerance: ±1%; RoHS: Compliant; Mounting Style: Surface Mount; Number of Pins: 2; Size-Length: 1.60 mm; Octopart URL: https://octopart.com/cr0603-fx-1001elf-bourns-2326646; Size-Thickness: 457 µm; OctopartID: a61f6f36030f79d8; Size-Width: 787 µm; Case/Package: 0603
U8 = CMP-m0xp0jkbbaqlzhag27re-16: TZT 2.4" 240x320 SPI TFT LCD Serial Port Module+5V/3.3V PBC Adapter Micro SD ILI9341; CustomComponentID: m0xp0jkbbaqlzhag27re